# EasyEDA Pro project ProPrj_平衡小车_2024-09-10.epro

# Schematic Schematic1_1
Board Name: Board1_1; Create Date: 2024-08-01; Page Name: 主板; Project Name: 平衡小车; Schematic Name: Schematic1_1; Update Date: 2024-08-01
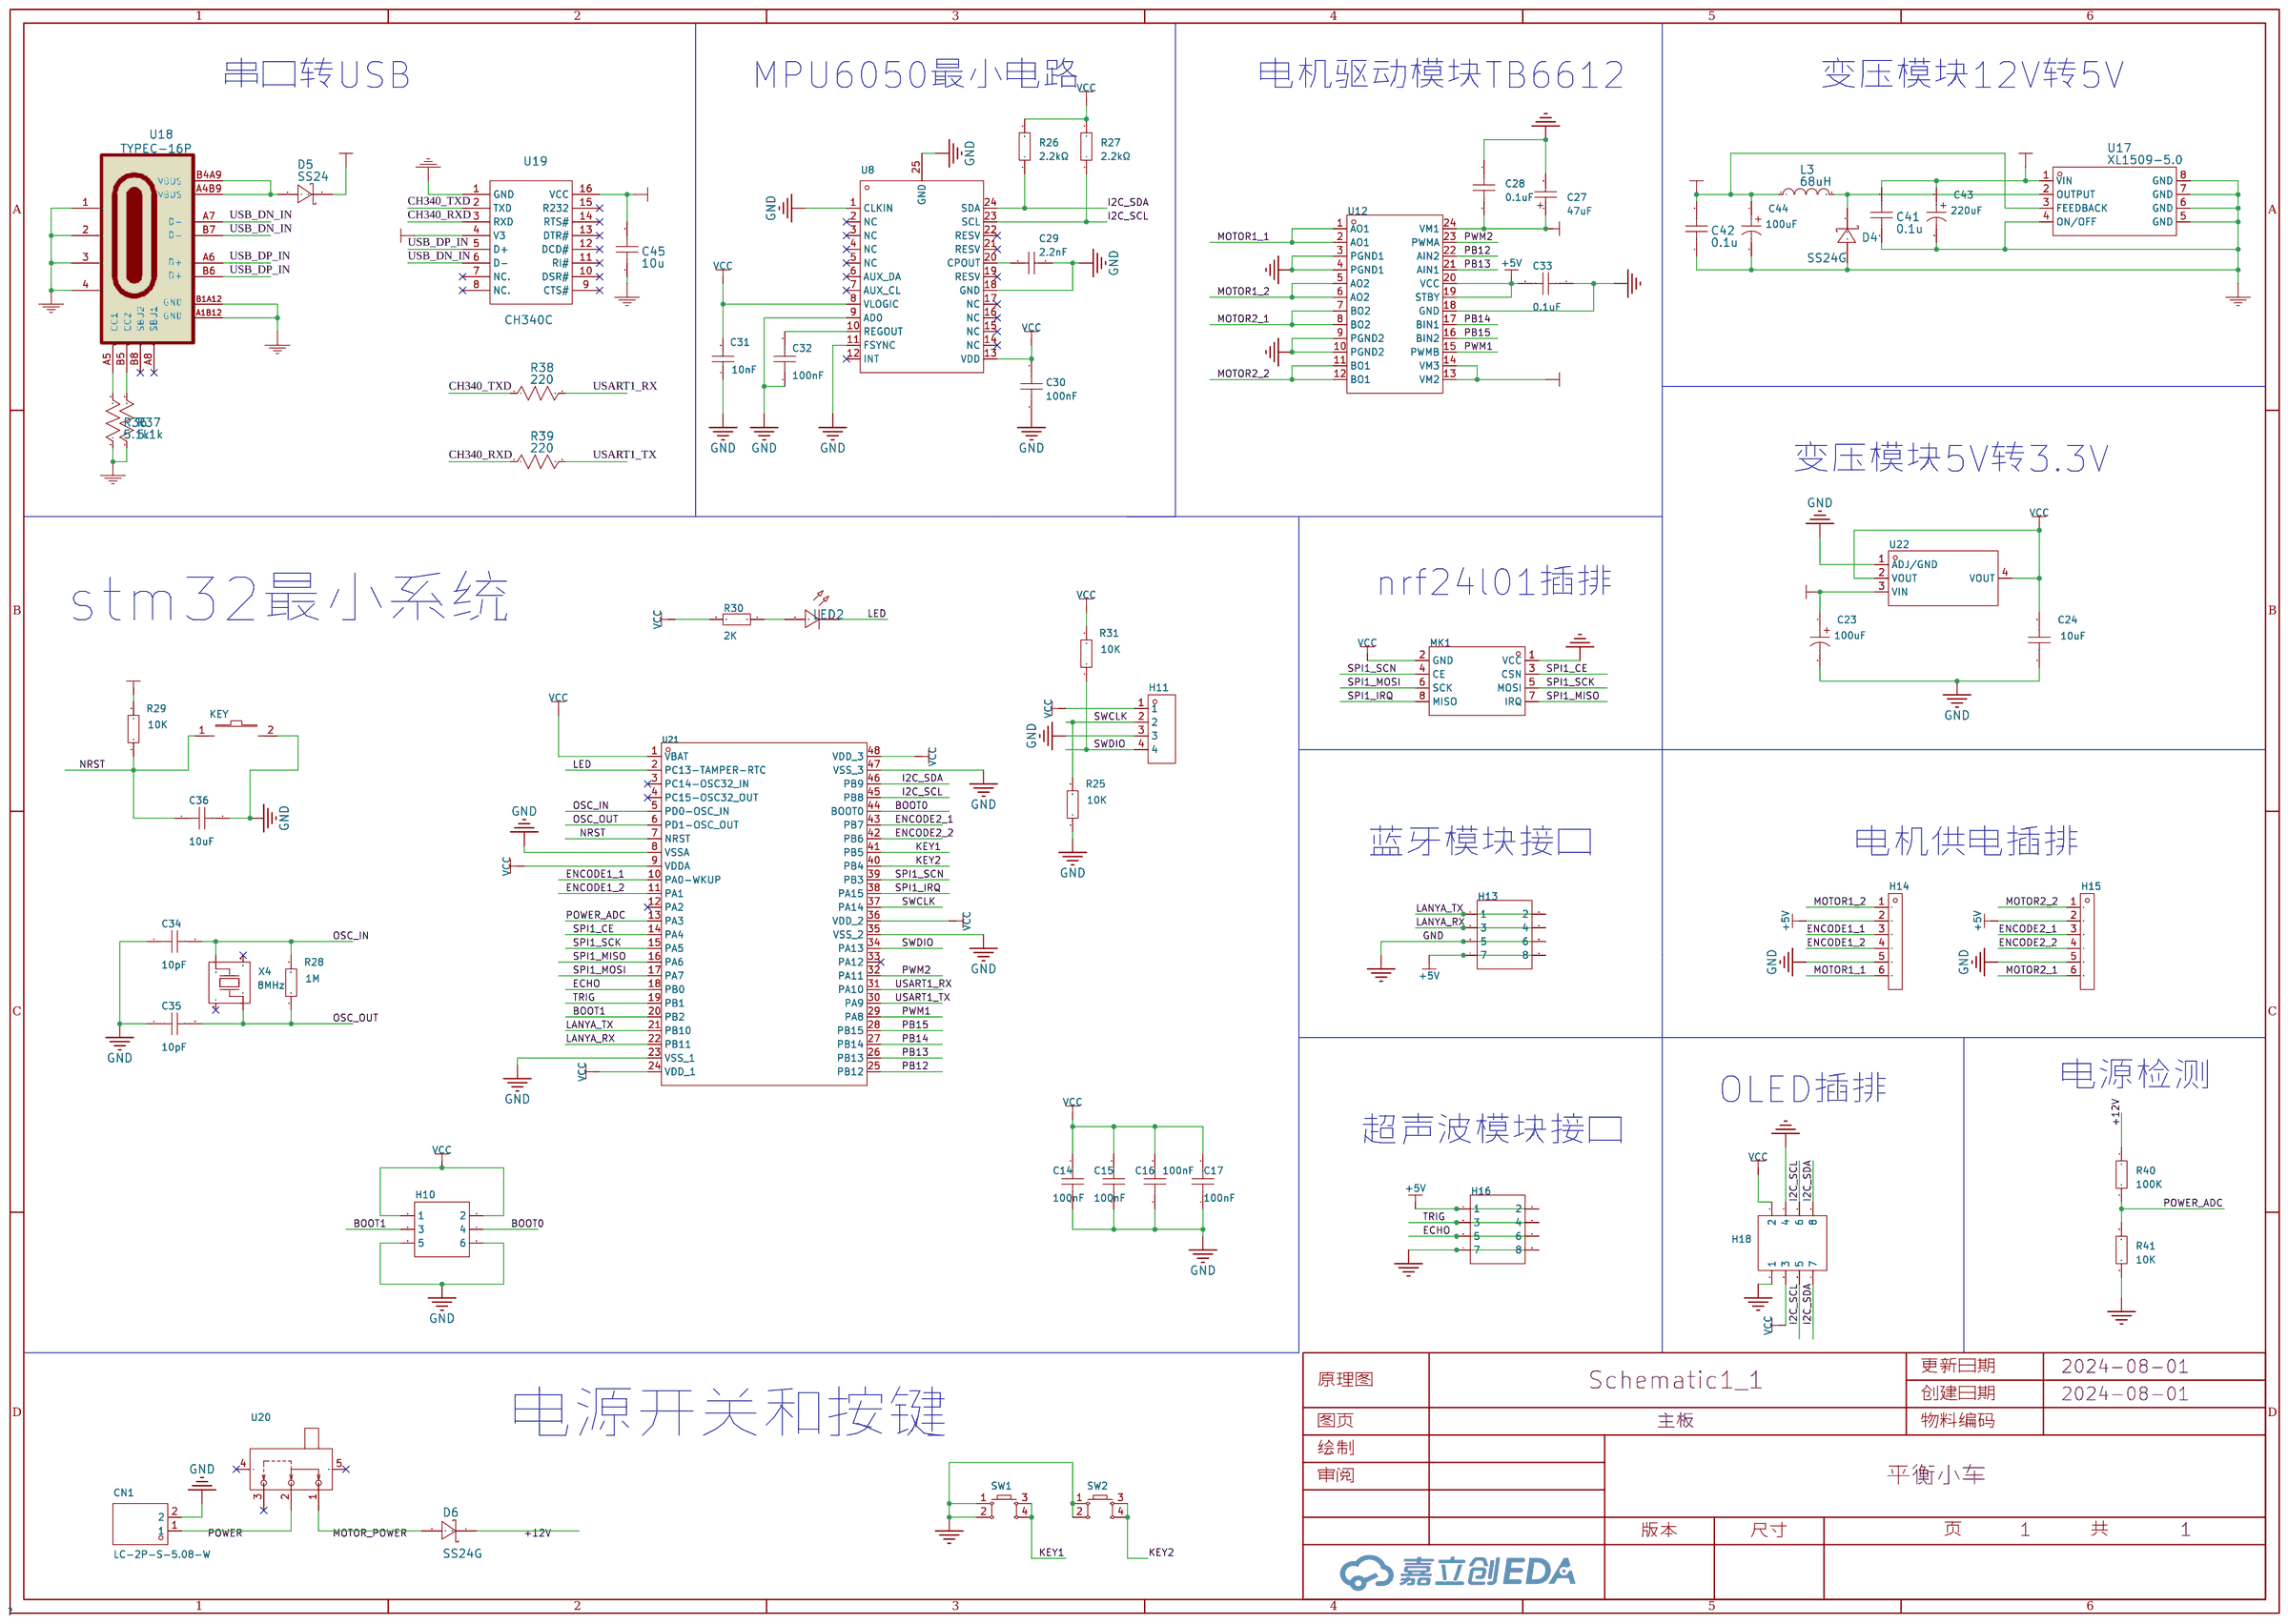
[diagram p0: schematic sheet]

## Parts
C14  100nF  [c0603]
C15  100nF  [c0603]
C16  100nF  [c0603]
C17  100nF  [c0603]
C23  100uF  [CAP-SMD_BD6.3-L6.6-W6.6-LS7.3-FD]
C24  10uF  [C0603]
C27  47uF  [CAP-SMD_L6.0-W3.2-R-RD]
C28  0.1uF  [C0603]
C29  2.2nF  [c0603]
C30  100nF  [c0603]
C31  10nF  [c0603]
C32  100nF  [c0603]
C33  0.1uF  [C0603]
C34  10pF  [C0603]
C35  10pF  [C0603]
C36  10uF  [C0603]
C41  0.1u  [C0603]
C42  0.1u  [C0603]
C43  220uF  [CAP-SMD_BD6.3-L6.6-W6.6-LS7.3-FD]
C44  100uF  [CAP-SMD_BD6.3-L6.6-W6.6-LS7.3-FD]
C45  10u  [C0603]
CN1  LC-2P-S-5.08-W  [CONN-TH_2P-P5.08_2EHDR-02P]
D4  SS24G  [SMA_L4.4-W2.8-LS5.4-RD]
D5  SS24  [SMA_L4.3-W2.6-LS5.2-RD]
D6  SS24G  [SMA_L4.4-W2.8-LS5.4-RD]
H10  -  [HDR-TH_6P-P2.54-V-F-R2-C3-S2.54]
H11  -  [HDR-TH_4P-P2.54-V-M]
H13  -  [HDR-TH_8P-P2.54-V-F-R2-C4-S2.54-1]
H14  -  [CONN-TH_XH-6AW]
H15  -  [CONN-TH_XH-6AW]
H16  -  [HDR-TH_8P-P2.54-V-F-R2-C4-S2.54-1]
H18  -  [HDR-TH_8P-P2.54-V-F-R2-C4-S2.54-1]
KEY  轻触开关3x4x2  [SW-SMD_L4.0-W2.9-LS5.0]
L3  68uH  [IND-SMD_L5.8-W5.2_CD54T125NP-100MC]
LED2  -  [LED0805-RD_RED]
MK1  NF-04  [WIRELM-SMD_NRF24L01]
R25  10K  [R0603]
R26  2.2kΩ  [r0603]
R27  2.2kΩ  [r0603]
R28  1M  [R0603]
R29  10K  [R0603]
R30  2K  [R0603]
R31  10K  [R0603]
R36  5.1k  [R0603]
R37  5.1k  [R0603]
R38  220  [R0603]
R39  220  [R0603]
R40  100K  [R0603]
R41  10K  [R0603]
SW1  -  [SW-TH_4P-L6.0-W6.0-P4.50-LS6.5]
SW2  -  [SW-TH_4P-L6.0-W6.0-P4.50-LS6.5]
U8  -  [QFN-24_L4.0-W4.0-P0.50-BL-EP2.7]
U12  TB6612FNG(O,C,8,EL  [SSOP-24_L8.4-W5.8-P0.65-LS7.8-BL]
U17  XL1509-5.0  [SOIC-8_L5.0-W4.0-P1.27-LS6.0-BL]
U18  TYPEC-16P  [TYPEC]
U19  CH340C  [SOP-16_L10.0-W3.9-P1.27-LS6.0-BL]
U20  SS-12F23-G4  [SW-TH_SS-12F23-G040]
U21  STM32F103C8T6  [LQFP-48_L7.0-W7.0-P0.50-LS9.0-BL]
U22  AMS1117-3.3  [SOT-223_L6.5-W3.5-P2.30-LS7.0-BR]
X4  8MHz  [OSC-SMD_4P-L3.2-W2.5-BL]

## Library data of the parts
C14-C17 = CAP_0805: Supplier Footprint: 0805
C23 C44 = XT100UF16V90RV0074: 容值:100uF;精度:±20%;额定电压:16V;电容体直径:6.3mm;电容体长度:7.7mm;纹波电流:85mA@120Hz;工作寿命:2000hrs@105;工作温度:-55~+105;; LCSC Part Name: 100uF ±20% 16V; Supplier Part: C2992605; Manufacturer: KNSCHA(科尼盛); Supplier Footprint: SMD,D6.3xL7.7mm; Datasheet: https://atta.szlcsc.com/upload/public/pdf/source/20220628/7CAC947F1CF7B3760324B7CEF365CD7C.pdf; Supplier: LCSC; Tolerance: ±20%; Rated Voltage: 16V; φD: 6.3mm; L: 7.7mm; Ripple Current: 85mA@120Hz; Lifetime @ Temp: 2000hrs@105; Operating Temperature: -55~+105
C24 C28 C33-C35 = CAP_0603: Supplier Footprint: 0603
C27 = TAJC476K016RNJ: 容值:47uF;精度:±10%;额定电压:16V;等效串联电阻:500mΩ@100kHz;; LCSC Part Name: 47uF ±10% 16V; Supplier Part: C7219; Manufacturer: Kyocera AVX; Supplier Footprint: CASE-C-6032; JLCPCB Part Class: 扩展库; Datasheet: https://atta.szlcsc.com/upload/public/pdf/source/20160107/1457707749304.pdf; Supplier: LCSC; Tolerance: ±10%; Rated Voltage: 16V; Equivalent Series Resistance(ESR): 500mΩ@100kHz; Operating Temperature: -55℃~+125℃
C29 = 0402B222K500NT: 容值:2.2nF;精度:±10%;额定电压:50V;材质(温度系数):X7R;; LCSC Part Name: 2.2nF ±10% 50V; Supplier Part: C1531; Manufacturer: FH(风华); Supplier Footprint: 0402; JLCPCB Part Class: 基础库; Datasheet: https://atta.szlcsc.com/upload/public/pdf/source/20170923/C1531_1506149258433988338.pdf; Supplier: LCSC; Tolerance: ±10%; Voltage Rated: 50V; Temperature Coefficient: X7R
C30 C32 = CC0402KRX7R7BB104: 容值:100nF;精度:±10%;额定电压:16V;材质(温度系数):X7R;; LCSC Part Name: 100nF ±10% 16V; Supplier Part: C60474; Manufacturer: YAGEO(国巨); Supplier Footprint: 0402; JLCPCB Part Class: 扩展库; Datasheet: https://atta.szlcsc.com/upload/public/pdf/source/20211223/9278FD768280B81DDBEF48FA36411A03.pdf; Supplier: LCSC; Tolerance: ±10%; Voltage Rated: 16V; Temperature Coefficient: X7R
C31 = CC0402KRX7R9BB103: 容值:10nF;精度:±10%;额定电压:50V;温度系数:X7R;; LCSC Part Name: 10nF ±10% 50V; Supplier Part: C60133; Manufacturer: YAGEO(国巨); Supplier Footprint: 0402; JLCPCB Part Class: Extended Part; Datasheet: https://atta.szlcsc.com/upload/public/pdf/source/20151201/1457707601869.pdf; Supplier: LCSC; Tolerance: ±10%; Voltage Rated: 50V; Temperature Coefficient: X7R
C36 = C0603: 容值:100nF;精度:±10%;额定电压:50V;材质(温度系数):X7R;; LCSC Part Name: 100nF ±10% 50V; Supplier Part: C14663; Manufacturer: YAGEO(国巨); Manufacturer Part: CC0603KRX7R9BB104; Supplier Footprint: 0603; JLCPCB Part Class: Basic Part; Datasheet: https://atta.szlcsc.com/upload/public/pdf/source/20170116/1484561234239.pdf; Supplier: LCSC; Tolerance: ±10%; Voltage Rated: 50V; Temperature Coefficient: X7R
C41 C42 = 0.1u
C43 = XT220UF25V90RV0075: 容值:220uF;额定电压:25V;电容体直径:-;电容体长度:-;纹波电流:-;等效串联电阻:-;工作寿命:-;; LCSC Part Name: 220uF 25V; Supplier Part: C2992606; Manufacturer: KNSCHA(科尼盛); Supplier Footprint: SMD,6.3x7.7mm; JLCPCB Part Class: 扩展库; Datasheet: https://atta.szlcsc.com/upload/public/pdf/source/20220628/B81E91792433B702C6CB5381AD404A15.pdf; Supplier: LCSC; Rated Voltage: 25V
C45 = 10u
CN1 = LC-2P-S-5.08-W: Supplier Part: C9900019070; JLCPCB Part Class: 扩展库; Datasheet: https://atta.szlcsc.comnull; Supplier: LCSC
D4 D6 = SS24G: Supplier: LCSC; Supplier Part: C183481; Manufacturer: SK; JLCPCB Part Class: Extended Part
D5 = SS24: Supplier: LCSC; Manufacturer: MDD; Supplier Part: C50645; JLCPCB Part Class: Extended Part
H10 = HDR-F_2.54_2x3: Supplier Part: C92272; Supplier Footprint: 插件
H11 = HDR-M_2.54_1x4P: Supplier Part: C492403; Supplier Footprint: 插件
H13 H16 H18 = HDR-F_2.54_2x4: Supplier Part: C92271; Supplier Footprint: 插件
H14 H15 = XH2.54-6P卧插: 参考系列:XH;间距:2.5mm;插针结构:1x6P;排数:1;每排PIN数:6;行距:-;安装方式:-;触头材质:-;; LCSC Part Name: XH-6AW，6P，脚距2.5mm，卧插; Supplier Part: C8876; Manufacturer: BOOMELE(博穆精密); Manufacturer Part: XH-6AW; LCSC On Sale: 1; Supplier Footprint: 插件,P=2.5mm; JLCPCB On Sale: 1; Datasheet: https://atta.szlcsc.com/upload/public/pdf/source/20151222/1457707652916.pdf; Supplier: LCSC; Reference Series: XH; Pitch: 2.5mm; Pins Structure: 1x6P; Number of Rows: 1; Number of PINs Per Row: 6; JLCPCB Part Class: 扩展库
KEY = 轻触开关3x4x2: 触点电流:50mA;额定电压(DC):12V;电路结构:单刀单掷;安装方式:立贴;按钮形状:圆形按钮;带灯:-;开关长度:4mm;开关宽度:3mm;开关高度:2mm;; LCSC Part Name: 3x4x2  柱高0.5; Supplier Part: C26638; Manufacturer: 国产; Supplier Footprint: SMD; JLCPCB Part Class: 扩展库; Datasheet: https://atta.szlcsc.com/upload/public/pdf/source/20150923/1457707412058.pdf; Supplier: LCSC; Contact Current: 50mA; Voltage Rating (DC): 12V; Circuit: 单刀单掷; Mounting Style: 立贴; Actuator Style: 圆形按钮; Switch Length: 4mm; Switch Width: 3mm; Switch Height: 2mm
L3 = CD54T125NP-100MC: Supplier: LCSC; Supplier Part: C171575; Manufacturer: Sumida; JLCPCB Part Class: Extended Part
LED2 = LED_0805-R: Supplier Footprint: 0805
MK1 = NRF24L01: 低成本NF-04台产芯片 功率加强版 最佳通讯距离240米，2.4G无线通讯模块; LCSC Part Name: NF-04 功率加强版 绑定 2.4G无线模块; Supplier Part: C90751; Manufacturer: Ai-Thinker(安信可); Supplier Footprint: 插件; JLCPCB Part Class: 扩展库; Datasheet: https://atta.szlcsc.com/upload/public/pdf/source/20190912/C90751_790912ADD510BE02DBCDD1D692AB4B0B.pdf; Supplier: LCSC
R25 R28-R31 R40 R41 = Res_0603: Supplier Footprint: 0603
R26 R27 = 0402WGF2201TCE: 电阻类型:厚膜电阻;阻值:2.2kΩ;精度:±1%;功率:62.5mW;温度系数:±100ppm/℃;最大工作电压:50V;工作温度范围:-55℃~+155℃;; LCSC Part Name: 2.2kΩ ±1% 62.5mW; Supplier Part: C25879; Manufacturer: UNI-ROYAL(厚声); Supplier Footprint: 0402; JLCPCB Part Class: 基础库; Datasheet: https://atta.szlcsc.com/upload/public/pdf/source/20200306/C422600_1E6D84923E4A46A82E41ADD87F860B5C.pdf; Supplier: LCSC; Type: 厚膜电阻; Tolerance: ±1%; Power(Watts): 62.5mW; Temperature Coefficient: ±100ppm/℃; Overload Voltage (Max): 50V; Operating Temperature Range: -55℃~+155℃
R36 R37 = 5.1k
R38 R39 = 220
SW1 SW2 = Key_TH_6x6x6: 触点电流:50mA;额定电压(DC):12V;绝缘电阻:100MΩ;电路结构:单刀单掷;安装方式:直插;按钮形状:圆形按钮;按钮/盖帽颜色:黑色;作用力:260gf@±30gf;工作温度:-25℃~+70℃;引脚样式:PC引脚;开关长度:6mm;开关宽度:6mm;开关高度:6mm;带支架:否;; Supplier Part: C2837516; Supplier Footprint: 插件
U8 = MPU-6050: 三轴加速度计和三轴陀螺仪，工作电压：2.375V~3.46V; Supplier Part: C24112; Manufacturer: TDK InvenSense(应美盛); Supplier Footprint: QFN-24_4x4x05P; JLCPCB Part Class: Basic Part; Datasheet: https://atta.szlcsc.com/upload/public/pdf/source/20140425/1457707046159.pdf; Supplier: LCSC
U12 = TB6612FNG(O,C,8,EL: 双直流电机驱动器集成电路; Supplier Part: C88224; Manufacturer: TOSHIBA(东芝); Supplier Footprint: SSOP-24-208mil; JLCPCB Part Class: 扩展库; Datasheet: https://atta.szlcsc.com/upload/public/pdf/source/20170412/1491969113864.pdf; Supplier: LCSC
U17 = XL1509-5.0: Supplier: LCSC; Supplier Part: C2681225; Manufacturer: UMW(友台半导体); JLCPCB Part Class: Extended Part
U18 = TYPEC-16P
U19 = CH340C: Supplier: LCSC; Manufacturer: WCH(南京沁恒); Supplier Part: C84681; JLCPCB Part Class: Extended Part
U20 = SS-12F23-G4: 电路结构:单刀双掷;安装方式:卧插;开关颜色:黑色;滑钮形状:矩形柱状;引脚样式:PC引脚;开关长度:13mm;开关宽度:5.8mm;开关高度:9mm;; LCSC Part Name: 拨动开关; Supplier Part: C2998806; Manufacturer: DEALON(德艺隆); Supplier Footprint: 插件; JLCPCB Part Class: 扩展库; Datasheet: https://atta.szlcsc.com/upload/public/pdf/source/20220428/B341684C4335C21BC408331FBC341DAE.pdf; Supplier: LCSC; Circuit: 单刀双掷; Mounting Style: 卧插; Actuator Color: 黑色; Actuator Style: 矩形柱状; Pin Style: PC引脚; Switch Length: 13mm; Switch Width: 5.8mm; Switch Height: 9mm
U21 = STM32F103C8T6: CPU内核:ARM Cortex-M3;CPU最大主频:72MHz;工作电压范围:2V~3.6V;内部振荡器:有;程序 FLASH容量:64K@x8bit;RAM总容量:20KB;EEPROM/数据 FLASH容量:-;GPIO端口数量:37;ADC(单元数/通道数/位数):1@x10ch/12bit;外设/功能/协议栈:看门狗；DMA；看门狗；片载温度传感器;工作温度范围:-40℃~+85℃;; LCSC Part Name: ARM Cortex-M3 72MHz 闪存：64K@x8bit RAM：20KB MSL=3; Supplier Part: C8734; Manufacturer: ST(意法半导体); Supplier Footprint: LQFP-48(7x7); JLCPCB Part Class: 扩展库; Supplier: LCSC; CPU Core: ARM Cortex-M3; Maximum Frequency: 72MHz; Supply Voltage Range: 2V~3.6V; Internal Oscillator: 有; Program FLASH Size: 64K@x8bit; RAM Size: 20KB; GPIO Ports Number: 37; ADC (Units/Channels/bits): 1@x10ch/12bit; Peripherals / Functions / Protocol Stacks: 看门狗；DMA；看门狗；片载温度传感器; Operating Temperature Range: -40℃~+85℃
U22 = AMS1117-3.3_C351785: Supplier Part: C351785; Manufacturer: PUOLOP(迪浦); Supplier Footprint: SOT-223; JLCPCB Part Class: 扩展库; Datasheet: https://atta.szlcsc.com/upload/public/pdf/source/20210915/EA806799CEEC3F52E0A4FA8303A508AC.pdf; Supplier: LCSC
X4 = TAXM8M4RDBCCT2T: 晶振类型:SMD 谐振器;频率:8MHz;频率公差:±10ppm;频率稳定度:±15ppm;负载电容:10pF;等效串联电阻(ESR):250Ω;工作温度:-;; LCSC Part Name: 8MHz ±10ppm 10pF; Supplier Part: C400090; Manufacturer: TAE(雅晶鑫); Supplier Footprint: SMD3225-4P; JLCPCB Part Class: 扩展库; Datasheet: https://atta.szlcsc.com/upload/public/pdf/source/20190626/C400090_CF95B89E745AFE4EF2E392EF8AC009D6.pdf; Supplier: LCSC; Crystal Type: SMD 谐振器; Frequency Tolerance: ±10ppm; Frequency Stability: ±15ppm; Load Capacitance: 10pF; Equivalent Series Resistance (ESR): 250Ω

## Nets
+5V: C23.1 C33.2 C42.2 C44.1 D5.1(K) H13.7 H13.8 H14.2 H15.2 H16.1 H16.2 L3.1 U12.19(STBY) U12.20(VCC) U17.3(FEEDBACK) U22.3(VIN)
+12V: C41.2 C43.1 D6.1 R40.2 U17.1(VIN)
GND: C14.1 C15.1 C16.1 C17.1 C23.2 C24.1 C27.2 C28.1 C29.2 C30.1 C31.1 C32.1 C33.1 C34.1 C35.1 C36.2 C41.1 C42.1 C43.2 C44.2 C45.1 CN1.2 D4.2 H10.5 H10.6 H11.3 H13.5 H13.6 H14.5 H15.5 H16.7 H16.8 H18.1 H18.4 KEY.2 MK1.1(VCC) R25.1 R36.1 R37.1 R41.1 SW1.1 SW1.2 SW2.1 SW2.2 U8.1(CLKIN) U8.9(AD0) U8.11(FSYNC) U8.18(GND) U8.25(GND) U12.3(PGND1) U12.4(PGND1) U12.9(PGND2) U12.10(PGND2) U12.18(GND) U17.4(ON/OFF) U17.5(GND) U17.6(GND) U17.7(GND) U17.8(GND) U18.1 U18.2(1) U18.3(1) U18.4(1) U18.A1B12(1) U18.B1A12(1) U19.1(GND) U21.8(VSSA) U21.23(VSS_1) U21.35(VSS_2) U21.47(VSS_3) U22.1(ADJ/GND)
VCC: C14.2 C15.2 C16.2 C17.2 C24.2 C30.2 C31.2 C45.2 H10.1 H10.2 H11.1 H18.2 H18.3 MK1.2(GND) R26.2 R27.2 R29.2 R30.2 R31.2 U8.8(VLOGIC) U8.13(VDD) U19.4(V3) U19.16(VCC) U21.1(VBAT) U21.9(VDDA) U21.24(VDD_1) U21.36(VDD_2) U21.48(VDD_3) U22.2(VOUT) U22.4(VOUT)
BOOT0: H10.4 U21.44(BOOT0)
BOOT1: H10.3 U21.20(PB2)
CH340_RXD: R39.1 U19.3(RXD)
CH340_TXD: R38.1 U19.2(TXD)
ECHO: H16.5 H16.6 U21.18(PB0)
ENCODE1_1: H14.3 U21.10(PA0-WKUP)
ENCODE1_2: H14.4 U21.11(PA1)
ENCODE2_1: H15.3 U21.43(PB7)
ENCODE2_2: H15.4 U21.42(PB6)
I2C_SCL: H18.5 H18.6 R27.1 U8.23(SCL) U21.45(PB8)
I2C_SDA: H18.7 H18.8 R26.1 U8.24(SDA) U21.46(PB9)
KEY1: SW1.3 SW1.4 U21.41(PB5)
KEY2: SW2.3 SW2.4 U21.40(PB4)
LANYA_RX: H13.3 H13.4 U21.22(PB11)
LANYA_TX: H13.1 H13.2 U21.21(PB10)
LED: LED2.1(C) U21.2(PC13-TAMPER-RTC)
MOTOR1_1: H14.6 U12.1(AO1) U12.2(AO1)
MOTOR1_2: H14.1 U12.5(AO2) U12.6(AO2)
MOTOR2_1: H15.6 U12.7(BO2) U12.8(BO2)
MOTOR2_2: H15.1 U12.11(BO1) U12.12(BO1)
MOTOR_POWER: C27.1 C28.2 D6.2 U12.13(VM2) U12.14(VM3) U12.24(VM1) U20.1
NRST: C36.1 KEY.1 R29.1 U21.7(NRST)
OSC_IN: C34.2 R28.2 U21.5(PD0-OSC_IN) X4.3
OSC_OUT: C35.2 R28.1 U21.6(PD1-OSC_OUT) X4.1
PB12: U12.22(AIN2) U21.25(PB12)
PB13: U12.21(AIN1) U21.26(PB13)
PB14: U12.17(BIN1) U21.27(PB14)
PB15: U12.16(BIN2) U21.28(PB15)
POWER: CN1.1 U20.2
POWER_ADC: R40.1 R41.2 U21.13(PA3)
PWM1: U12.15(PWMB) U21.29(PA8)
PWM2: U12.23(PWMA) U21.32(PA11)
SPI1_CE: MK1.3(CSN) U21.14(PA4)
SPI1_IRQ: MK1.8(MISO) U21.38(PA15)
SPI1_MISO: MK1.7(IRQ) U21.16(PA6)
SPI1_MOSI: MK1.6(SCK) U21.17(PA7)
SPI1_SCK: MK1.5(MOSI) U21.15(PA5)
SPI1_SCN: MK1.4(CE) U21.39(PB3)
SWCLK: H11.2 R25.2 U21.37(PA14)
SWDIO: H11.4 R31.1 U21.34(PA13)
TRIG: H16.3 H16.4 U21.19(PB1)
USART1_RX: R38.2 U21.31(PA10)
USART1_TX: R39.2 U21.30(PA9)
USB_DN_IN: U18.A7(1) U18.B7(1) U19.6(D-)
USB_DP_IN: U18.A6(1) U18.B6(1) U19.5(D+)
Net-(C29-1): C29.1 U8.20(CPOUT)
Net-(C32-2): C32.2 U8.10(REGOUT)
Net-(D4-1): D4.1 L3.2 U17.2(OUTPUT)
Net-(D5-2): D5.2(A) U18.A4B9(1) U18.B4A9(1)
Net-(LED2-2): LED2.2(A) R30.1
Net-(R36-2): R36.2 U18.A5(1)
Net-(R37-2): R37.2 U18.B5(1)

Not connected (* = marked no-connect by the designer): U8 2(NC)* 3(NC)* 4(NC)* 5(NC)* 6(AUX_DA)* 7(AUX_CL)* 12(INT)* 14(NC)* 15(NC)* 16(NC)* 17(NC)* 19(RESV)* 21(RESV)* 22(RESV)*; U18 A8(1)* B8(1)*; U19 7(NC.)* 8(NC.)* 9(CTS#)* 10(DSR#)* 11(RI#)* 12(DCD#)* 13(DTR#)* 14(RTS#)* 15(R232)*; U20 3* 4* 5*; U21 3(PC14-OSC32_IN)* 4(PC15-OSC32_OUT)* 12(PA2)* 33(PA12)*; X4 2* 4*

## Notes on the sheet
- 串口转USB
- MPU6050最小电路
- 电机驱动模块TB6612
- 变压模块12V转5V
- 变压模块5V转3.3V
- nrf24l01插排
- stm32最小系统
- 蓝牙模块接口
- 电机供电插排
- 电源检测
- OLED插排
- 超声波模块接口
- 电源开关和按键

# Schematic Schematic1
Board Name: Board1; Create Date: 2024-09-07
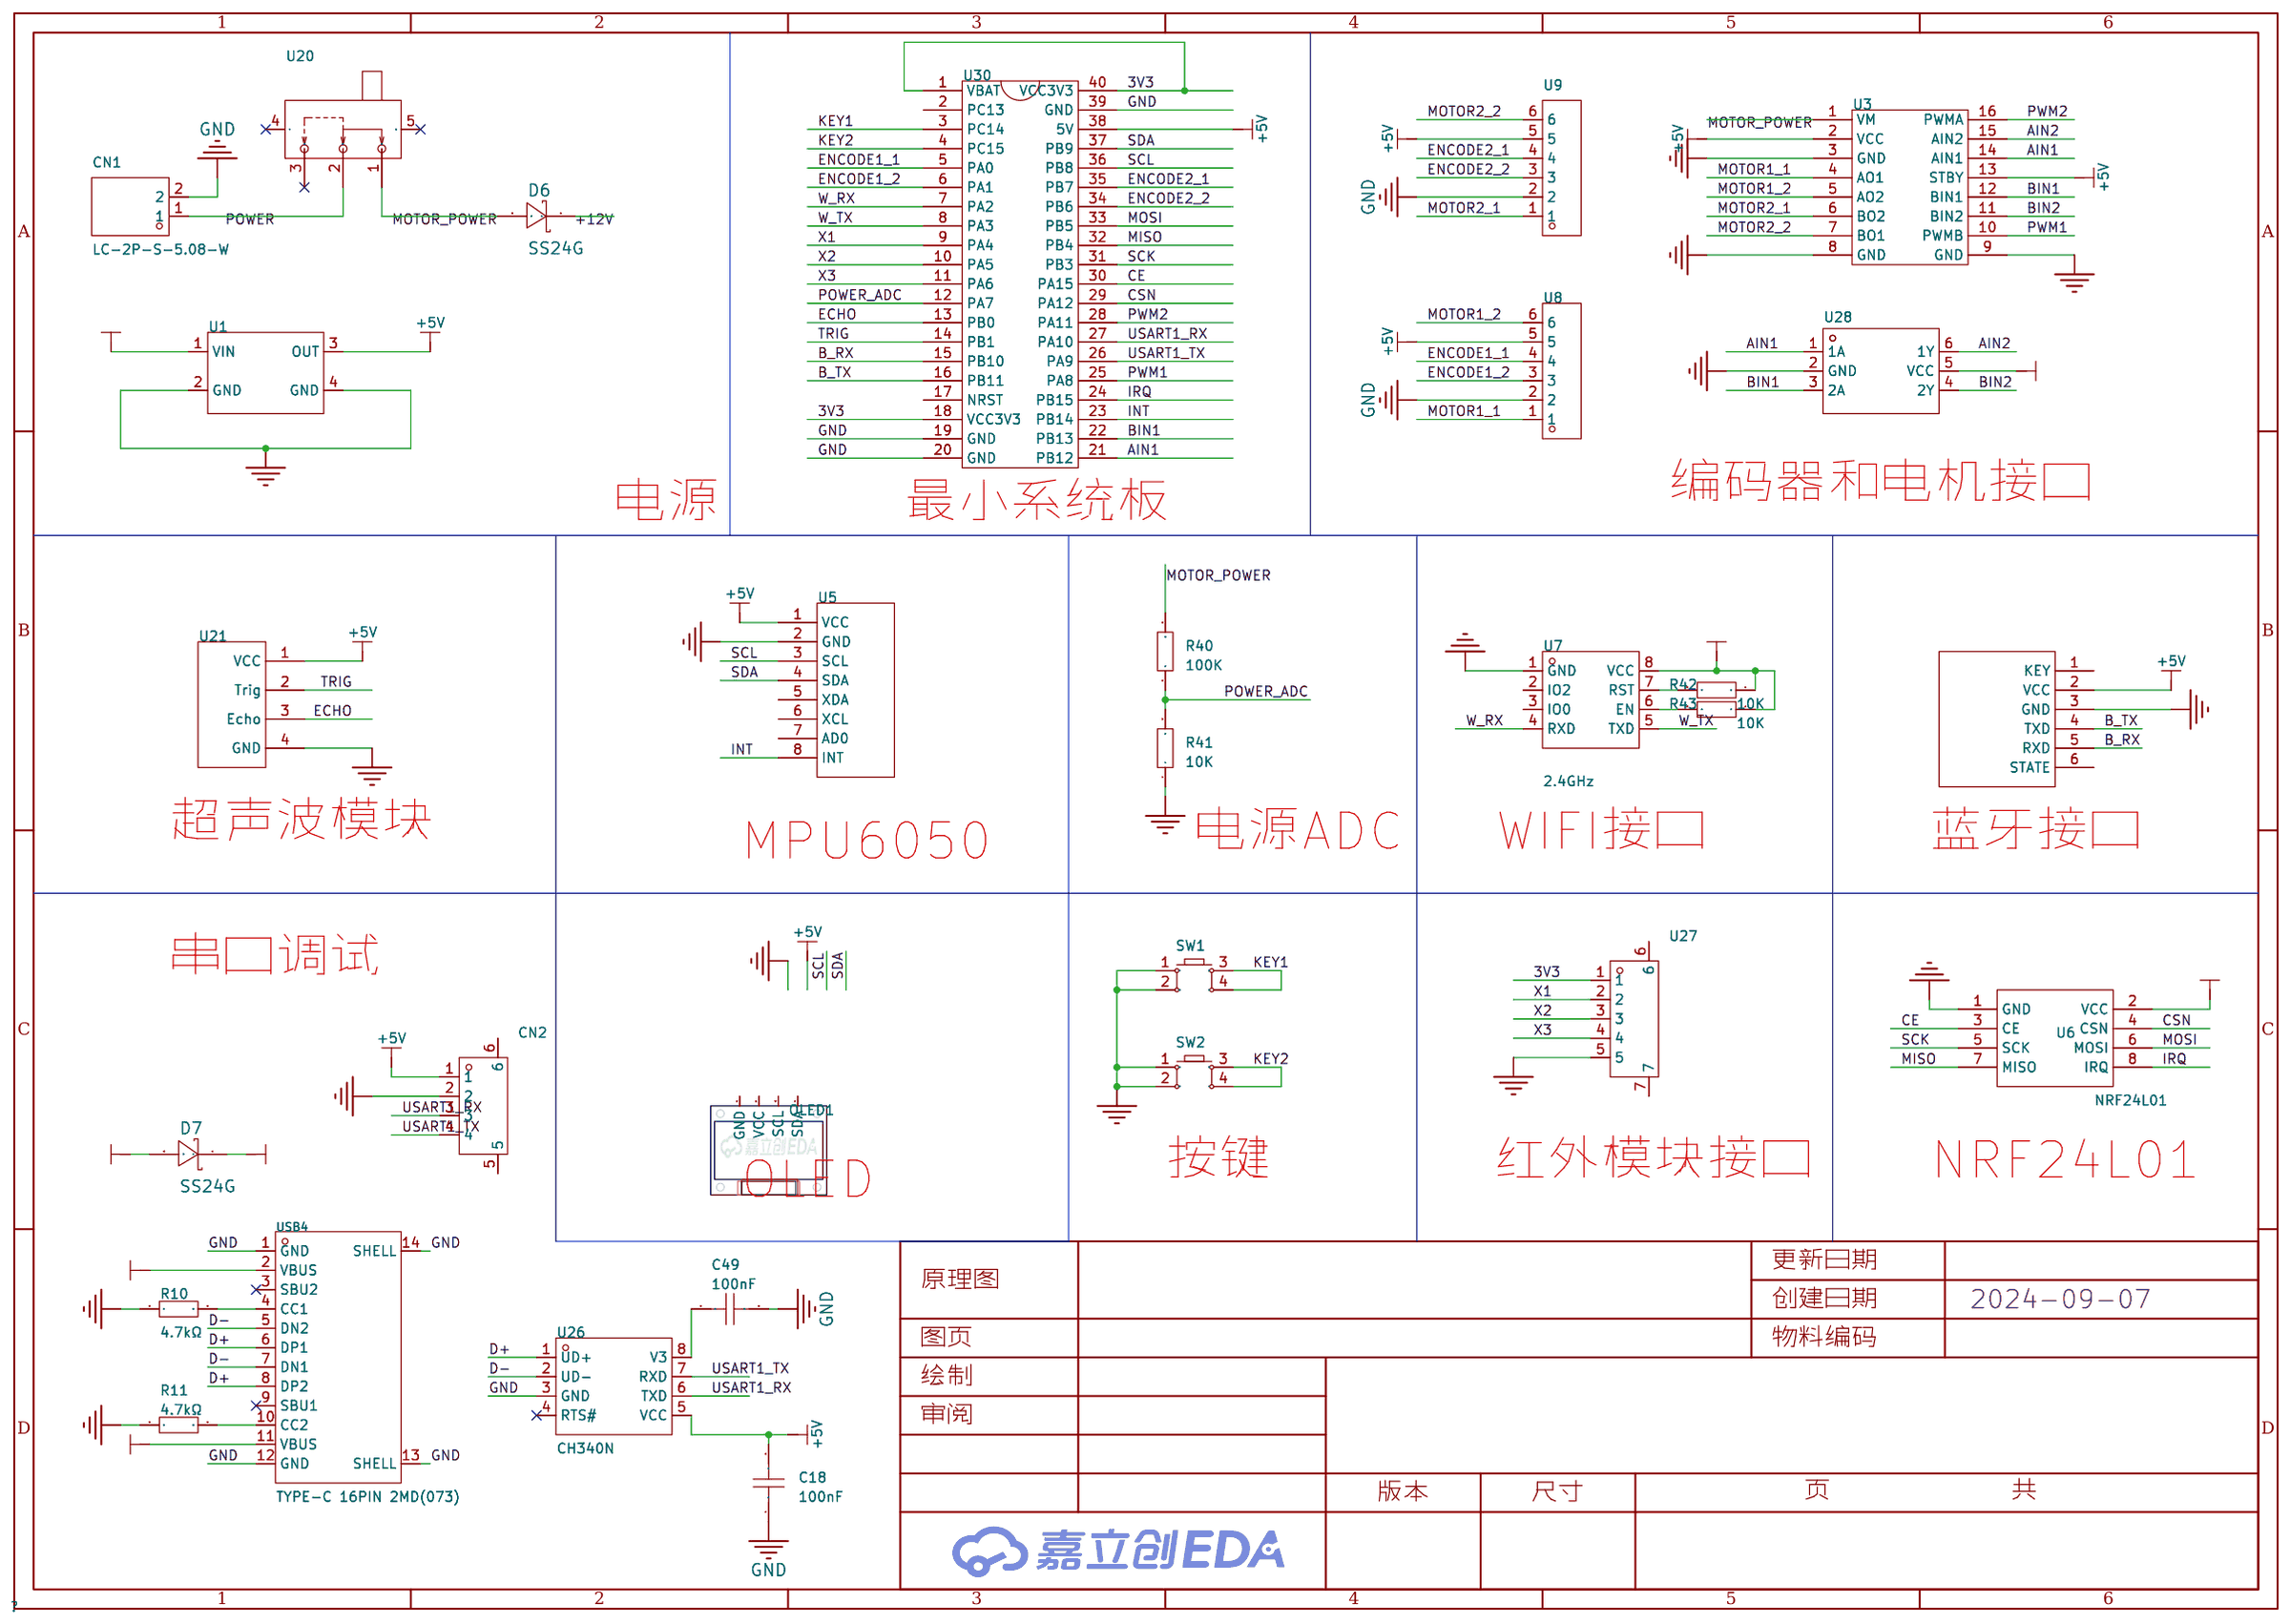
[diagram p1: schematic sheet]

## Parts
BLUETOOTH  JDY-31  [HC-05 PCB]
C18  100nF  [c0603]
C49  100nF  [c0603]
CN1  LC-2P-S-5.08-W  [CONN-TH_2P-P5.08_2EHDR-02P]
CN2  XH2.54-4P  [CONN-SMD_4P-P2.50-WT]
D6  SS24G  [SMA_L4.4-W2.8-LS5.4-RD]
D7  SS24G  [SMA_L4.4-W2.8-LS5.4-RD]
OLED1  -  [0.96OLED_4P]
R10  4.7kΩ  [r0603]
R11  4.7kΩ  [r0603]
R40  100K  [R0603]
R41  10K  [R0603]
R42  10K  [R0603]
R43  10K  [R0603]
SW1  -  [SW-SMD_4P-L6.0-W6.0-P4.50-LS9.0-2]
SW2  -  [SW-SMD_4P-L6.0-W6.0-P4.50-LS9.0-2]
U1  -  [MP1584模块]
U3  TB6612  [TB6612模块]
U5  MPU6050模块  [GY521]
U6  2.4G  [NRF24L01]
U7  2.4GHz  [WIFIM-TH_8P-L24.7-W14.4-P2.54]
U8  WAFER-XH2.54-6PWZ  [CONN-TH_6P-P2.50_WAFER-XH2.54-6PWZ]
U9  WAFER-XH2.54-6PWZ  [CONN-TH_6P-P2.50_WAFER-XH2.54-6PWZ]
U20  SS-12F23-G4  [SW-TH_SS-12F23-G040]
U21  超声波模块  [HC-SRO4超声波模块]
U26  CH340N  [SOP-8_L4.9-W3.9-P1.27-LS6.0-BL]
U27  XH2.54-5P,卧式  [CONN-SMD_5P-P2.50_XUNPU_WAFER-254W-5P]
U28  SN74LVC2GU04DBVR  [SOT-23-6_L2.9-W1.6-P0.95-LS2.8-BR]
U30  STM32C8T6开发板  [STM32C8T6]
USB4  TYPE-C 16PIN 2MD(073)  [USB-C-SMD_TYPE-C-6PIN-2MD-073]

## Library data of the parts
BLUETOOTH = HC-05: Pin Type: IN
C18 C49 = CC0603KRX7R8BB104: 容值:100nF;精度:±10%;额定电压:25V;材质(温度系数):X7R;; LCSC Part Name: 100nF ±10% 25V; Supplier Part: C92490; Manufacturer: YAGEO(国巨); Supplier Footprint: 0603; JLCPCB Part Class: Extended Part; Datasheet: https://atta.szlcsc.com/upload/public/pdf/source/20170105/1483610795587.pdf; Supplier: LCSC; Tolerance: ±10%; Voltage Rated: 25V; Temperature Coefficient: X7R
CN1 = LC-2P-S-5.08-W: Supplier Part: C9900019070; JLCPCB Part Class: 扩展库; Datasheet: https://atta.szlcsc.comnull; Supplier: LCSC
CN2 = XH2.54-4P: Supplier Part: C9900004347; Supplier Footprint: XH2.54-3PSMD; JLCPCB Part Class: 扩展库; Supplier: LCSC
D6 D7 = SS24G: Supplier: LCSC; Supplier Part: C183481; Manufacturer: SK; JLCPCB Part Class: Extended Part
OLED1 = 0.96OLED模块_4P: Supplier Footprint: 插件
R10 R11 = 0603WAF4701T5E: 电阻类型:厚膜电阻;阻值:4.7kΩ;精度:±1%;功率:100mW;最大工作电压:75V;温度系数:±100ppm/℃;; LCSC Part Name: 4.7kΩ ±1% 100mW 厚膜电阻; Supplier Part: C23162; Manufacturer: UNI-ROYAL(厚声); Supplier Footprint: 0603; JLCPCB Part Class: Basic Part; Datasheet: https://atta.szlcsc.com/upload/public/pdf/source/20200306/C422600_1E6D84923E4A46A82E41ADD87F860B5C.pdf; Supplier: LCSC; Type: 厚膜电阻; Tolerance: ±1%; Power(Watts): 100mW; Overload Voltage (Max): 75V; Temperature Coefficient: ±100ppm/℃; Operating Temperature Range: -55℃~+155℃
R40-R43 = Res_0603: Supplier Footprint: 0603
SW1 SW2 = Key_SMD_6x6x6.5: Supplier Footprint: SMD
U1 = MP1584模块: Pin Type: IN; _: 3
U3 = TB6612模块
U5 = MPU6050模块
U6 = NRF24L01
U7 = ESP-01: 核心处理器:-;频率:2.4GHz;天线形式:板载PCB天线;发射功率:16dBm;接收灵敏度:-90dBm;; LCSC Part Name: 体积超小的802.11b/g/nWi-FiSOC模块; Supplier Part: C503581; Manufacturer: Ai-Thinker(安信可); JLCPCB Part Class: 扩展库; Datasheet: https://atta.szlcsc.com/upload/public/pdf/source/20200407/C503581_BFDAA19F4B592DB0CEE4D61B6918C625.pdf; Supplier: LCSC; Support Interface: GPIO；UART; Antenna Type: 板载PCB天线; Output Power: 16dBm; Operating Voltage: 3V~3.6V; Sensitivity: -90dBm; Operating Temperature: -20℃~+85℃
U8 U9 = WAFER-XH2.54-6PWZ: 插针结构:1x6P;间距:2.54mm;安装方式:弯插;总PIN数:6P;排数:1;每排PIN数:6;额定电流:2A;工作温度范围:-25℃~+85℃;; LCSC Part Name: XH 2.54mm 1x6P 弯插; Supplier Part: C5359643; Manufacturer: XUNPU(讯普); Supplier Footprint: 弯插,P=2.5mm; JLCPCB Part Class: 扩展库; Datasheet: https://atta.szlcsc.com/upload/public/pdf/source/20230221/397FB6E0B838EFC6EA17AAEABEF58A8D.pdf; Supplier: LCSC; Pins Structure: 1x6P; Pitch: 2.54mm; Mounting Style: 弯插; Number of Pins: 6P; Number of Rows: 1; Number of PINs Per Row: 6; Current Rating (Max): 2A; Operating Temperature Range: -25℃~+85℃
U20 = SS-12F23-G4: 电路结构:单刀双掷;安装方式:卧插;开关颜色:黑色;滑钮形状:矩形柱状;引脚样式:PC引脚;开关长度:13mm;开关宽度:5.8mm;开关高度:9mm;; LCSC Part Name: 拨动开关; Supplier Part: C2998806; Manufacturer: DEALON(德艺隆); Supplier Footprint: 插件; JLCPCB Part Class: 扩展库; Datasheet: https://atta.szlcsc.com/upload/public/pdf/source/20220428/B341684C4335C21BC408331FBC341DAE.pdf; Supplier: LCSC; Circuit: 单刀双掷; Mounting Style: 卧插; Actuator Color: 黑色; Actuator Style: 矩形柱状; Pin Style: PC引脚; Switch Length: 13mm; Switch Width: 5.8mm; Switch Height: 9mm
U21 = 超声波模块
U26 = CH340N: LCSC Part Name: USB转串口芯片 CH340; Supplier Part: C2977777; Manufacturer: WCH(南京沁恒); Supplier Footprint: SOP-8; JLCPCB Part Class: 扩展库; Datasheet: https://atta.szlcsc.com/upload/public/pdf/source/20230530/6E401E9554E9F5311886CC8B3F89B62E.pdf; Supplier: LCSC
U27 = XH2.54-5P,卧式: Supplier Part: C9900019986; Supplier Footprint: CONN-SMD_5P-P2.50; JLCPCB Part Class: 扩展库; Supplier: LCSC
U28 = SN74LVC2GU04DBVR: 电源电压:1.65V~5.5V;供电电流(最大值):10uA;电路数:2;最大传播延迟(tpd):3.5ns@5V,50pF;; Supplier Part: C139427; Manufacturer: TI(德州仪器); Supplier Footprint: SOT-23-6; JLCPCB Part Class: 扩展库; Datasheet: https://www.ti.com/cn/lit/gpn/sn74lvc2gu04; Supplier: LCSC; Supply Voltage(Single): 1.65V~5.5V; Supply Current (Max): 10uA; Number of Circuits: 2; Number of Inputs: 2; Sink Current: 32mA; Source Current: 32mA; High level range (VIH): 1.24V~4.13V; Low level range (VIL): 410mV~1.38V; Max Propagation Delay: 3.5ns@5V,50pF; Series: 74LVC系列; Operating Temperature: -40℃~+125℃
U30 = STM32C8T6
USB4 = TYPE-C 16PIN 2MD(073): 连接器类型:Type-C;标准:-;公母:母座;触点数量:16;端口数量:1;安装方式:卧贴;额定电流 - 电源:5A;工作温度范围:-25℃~+85℃;; LCSC Part Name: TYPE-C母座 16P 4脚插件带定位柱 不锈钢外壳 2次模顶; Supplier Part: C2765186; Manufacturer: SHOU HAN(首韩); Supplier Footprint: SMD; JLCPCB Part Class: 扩展库; Supplier: LCSC; Connector Type: Type-C; Gender: 母座; Number of Contacts: 16; Number of Ports: 1; Mounting Style: 卧贴; Current Rating - Power (Max): 5A; Operating Temperature Range: -25℃~+85℃

## Nets
3V3: R42.1 R43.1 U6.2(VCC) U7.8(VCC) U27.1 U28.5(VCC) U30.1(VBAT) U30.18(VCC3V3) U30.40(VCC3V3)
+5V: BLUETOOTH.2(VCC) C18.2 CN2.1 D7.1 U1.3(OUT) U3.2(VCC) U3.13(STBY) U5.1(VCC) U8.5 U9.5 U21.1(VCC) U26.5(VCC) U30.38(5V)
+12V: D6.1 U1.1(VIN)
GND: BLUETOOTH.3(GND) C18.1 C49.2 CN1.2 CN2.2 R10.1 R11.1 R41.1 SW1.1 SW1.2 SW2.1 SW2.2 U1.2(GND) U1.4(GND) U3.3(GND) U3.8(GND) U3.9(GND) U5.2(GND) U6.1(GND) U7.1(GND) U8.2 U9.2 U21.4(GND) U26.3(GND) U27.5 U28.2(GND) U30.19(GND) U30.20(GND) U30.39(GND) USB4.1(GND) USB4.12(GND) USB4.13(SHELL) USB4.14(SHELL)
VBUS: D7.2 USB4.2(VBUS) USB4.11(VBUS)
AIN1: U3.14(AIN1) U28.1(1A) U30.21(PB12)
AIN2: U3.15(AIN2) U28.6(1Y)
B_RX: BLUETOOTH.5(RXD) U30.15(PB10)
B_TX: BLUETOOTH.4(TXD) U30.16(PB11)
BIN1: U3.12(BIN1) U28.3(2A) U30.22(PB13)
BIN2: U3.11(BIN2) U28.4(2Y)
CE: U6.3(CE) U30.30(PA15)
CSN: U6.4(CSN) U30.29(PA12)
D+: U26.1(UD+) USB4.6(DP1) USB4.8(DP2)
D-: U26.2(UD-) USB4.5(DN2) USB4.7(DN1)
ECHO: U21.3(Echo) U30.13(PB0)
ENCODE1_1: U8.4 U30.5(PA0)
ENCODE1_2: U8.3 U30.6(PA1)
ENCODE2_1: U9.4 U30.35(PB7)
ENCODE2_2: U9.3 U30.34(PB6)
INT: U5.8(INT) U30.23(PB14)
IRQ: U6.8(IRQ) U30.24(PB15)
KEY1: SW1.3 SW1.4 U30.3(PC14)
KEY2: SW2.3 SW2.4 U30.4(PC15)
MISO: U6.7(MISO) U30.32(PB4)
MOSI: U6.6(MOSI) U30.33(PB5)
MOTOR1_1: U3.4(AO1) U8.1
MOTOR1_2: U3.5(AO2) U8.6
MOTOR2_1: U3.6(BO2) U9.1
MOTOR2_2: U3.7(BO1) U9.6
MOTOR_POWER: D6.2 R40.2 U3.1(VM) U20.1
POWER: CN1.1 U20.2
POWER_ADC: R40.1 R41.2 U30.12(PA7)
PWM1: U3.10(PWMB) U30.25(PA8)
PWM2: U3.16(PWMA) U30.28(PA11)
SCK: U6.5(SCK) U30.31(PB3)
SCL: U5.3(SCL) U30.36(PB8)
SDA: U5.4(SDA) U30.37(PB9)
TRIG: U21.2(Trig) U30.14(PB1)
USART1_RX: CN2.3 U26.6(TXD) U30.27(PA10)
USART1_TX: CN2.4 U26.7(RXD) U30.26(PA9)
W_RX: U7.4(RXD) U30.7(PA2)
W_TX: U7.5(TXD) U30.8(PA3)
X1: U27.2 U30.9(PA4)
X2: U27.3 U30.10(PA5)
X3: U27.4 U30.11(PA6)
$1N2843: C49.1 U26.8(V3)
$1N2852: R10.2 USB4.4(CC1)
$1N2853: R11.2 USB4.10(CC2)
$1N4790: R42.2 U7.7(RST)
$1N4794: R43.2 U7.6(EN)

Not connected (* = marked no-connect by the designer): BLUETOOTH 1(KEY) 6(STATE); CN2 5 6; OLED1 1(GND) 2(VCC) 3(SCL) 4(SDA); U5 5(XDA) 6(XCL) 7(AD0); U7 2(IO2) 3(IO0); U20 3* 4* 5*; U26 4(RTS#)*; U27 6 7; U30 2(PC13) 17(NRST); USB4 3(SBU2)* 9(SBU1)*

## Notes on the sheet
- 电源
- 最小系统板
- 编码器和电机接口
- 超声波模块
- MPU6050
- 电源ADC
- WIFI接口
- 蓝牙接口
- 串口调试
- 按键
- 红外模块接口
- NRF24L01
- OLED

# Board PCB1
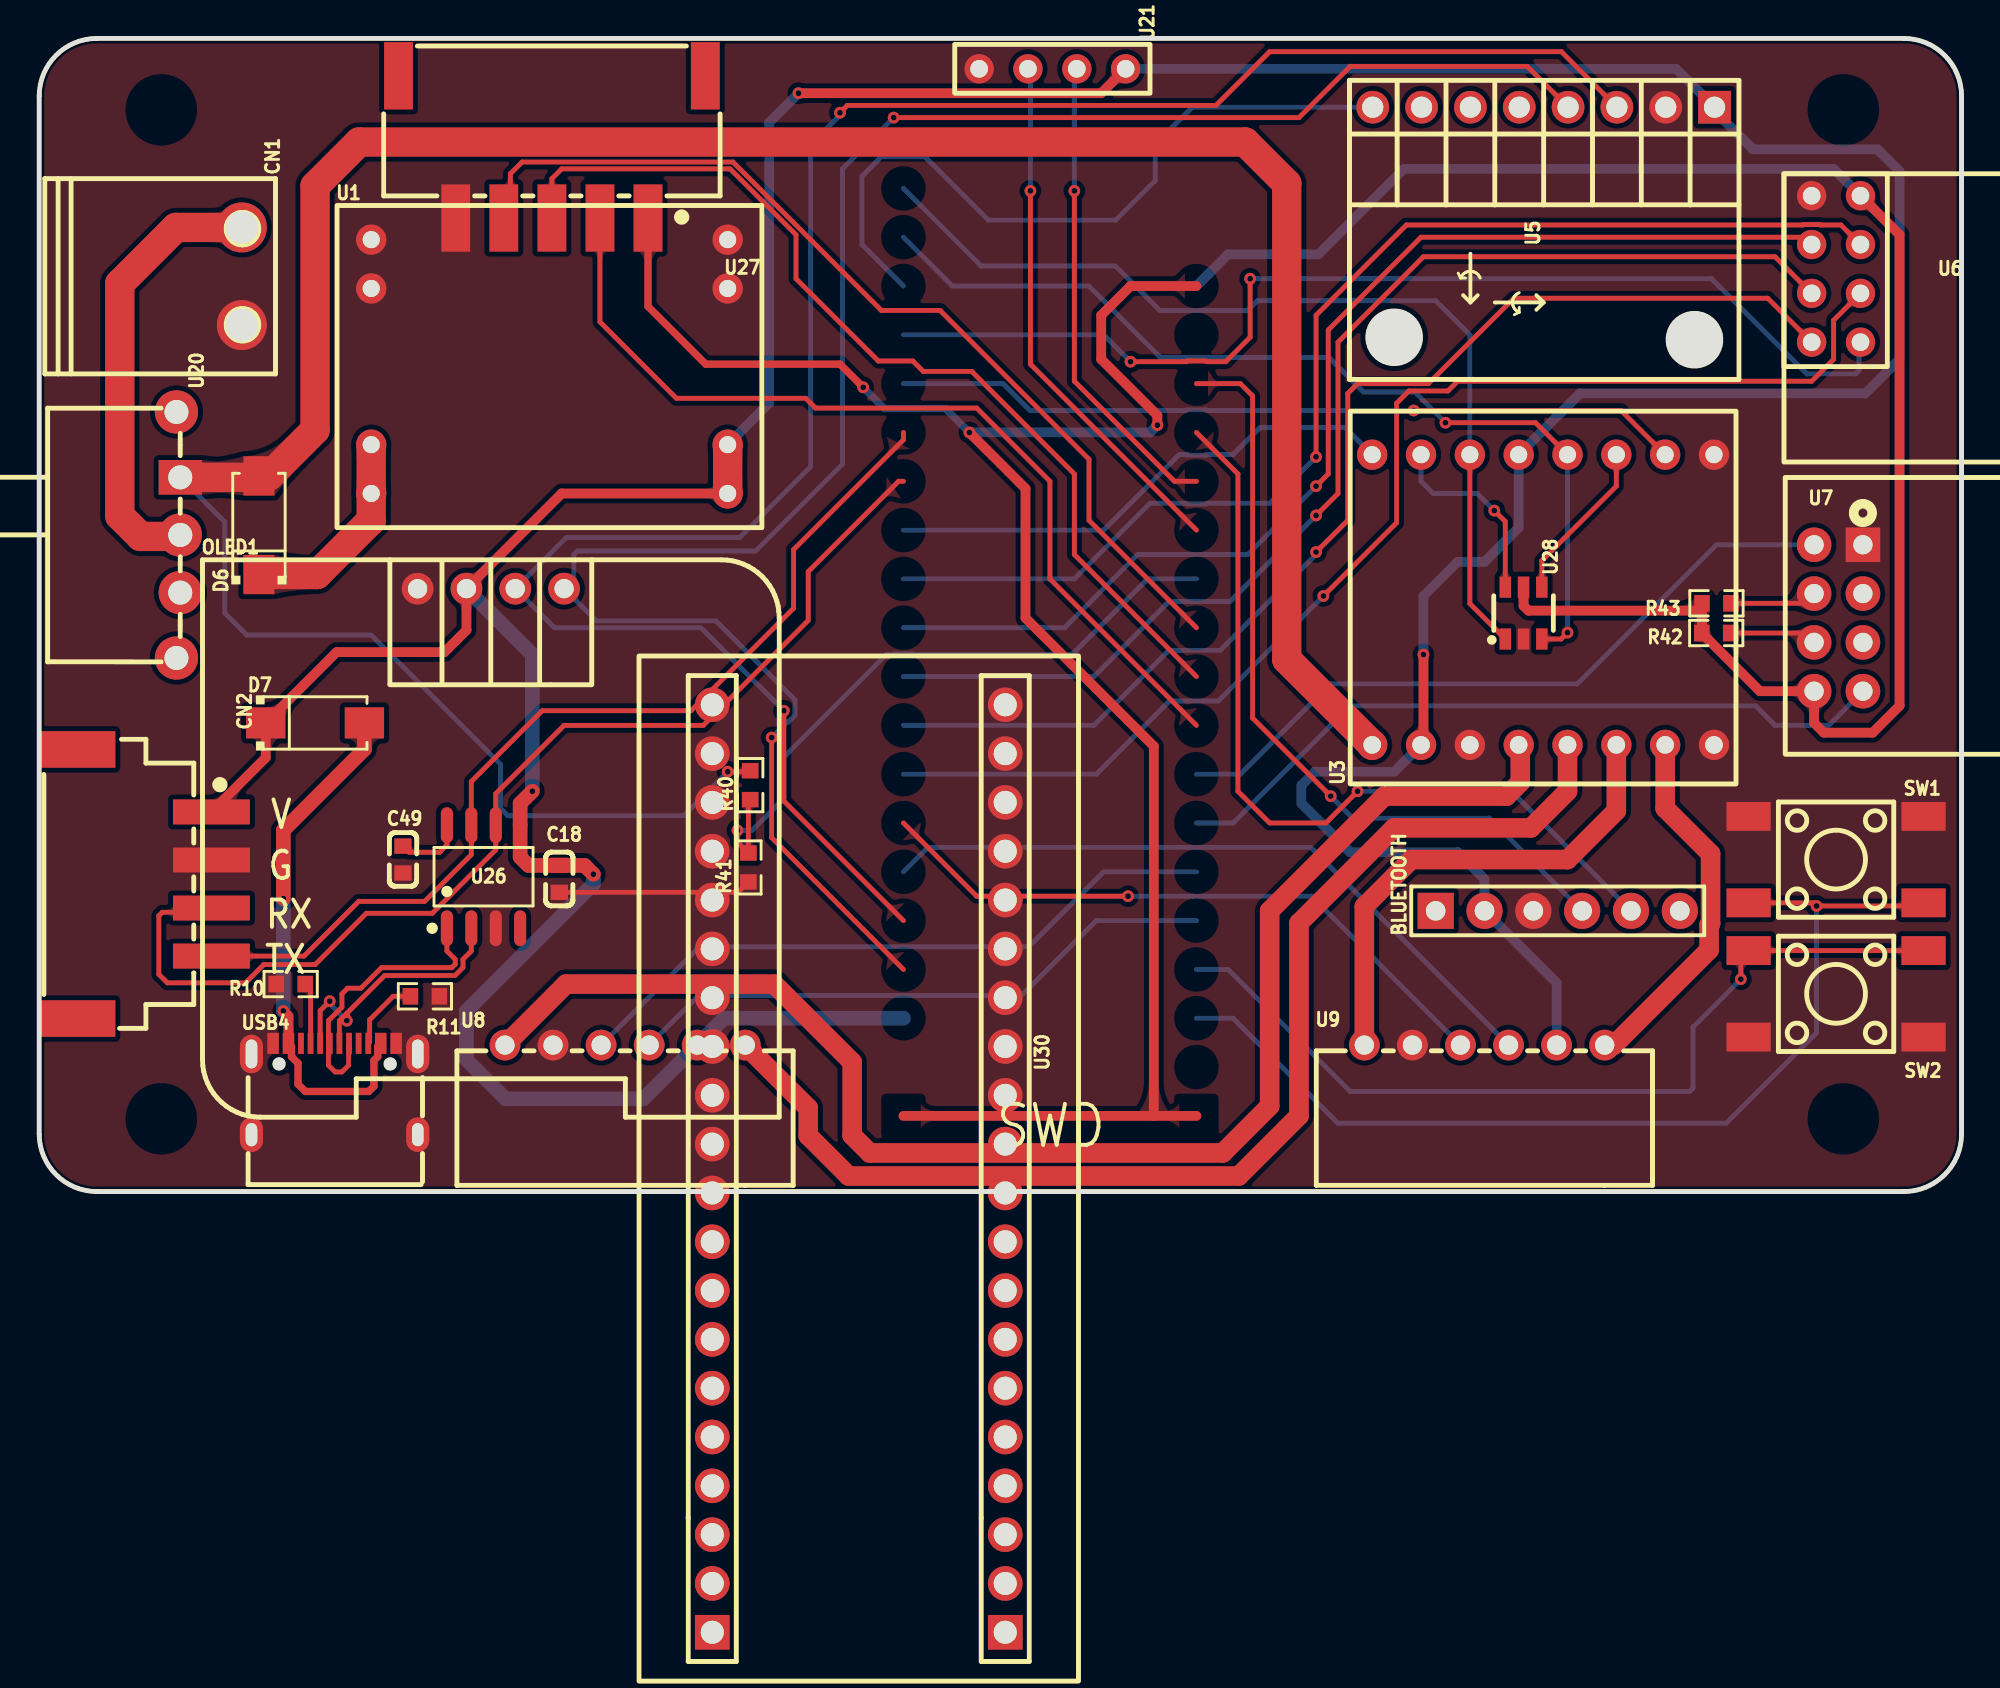
[diagram p2: board, top side]
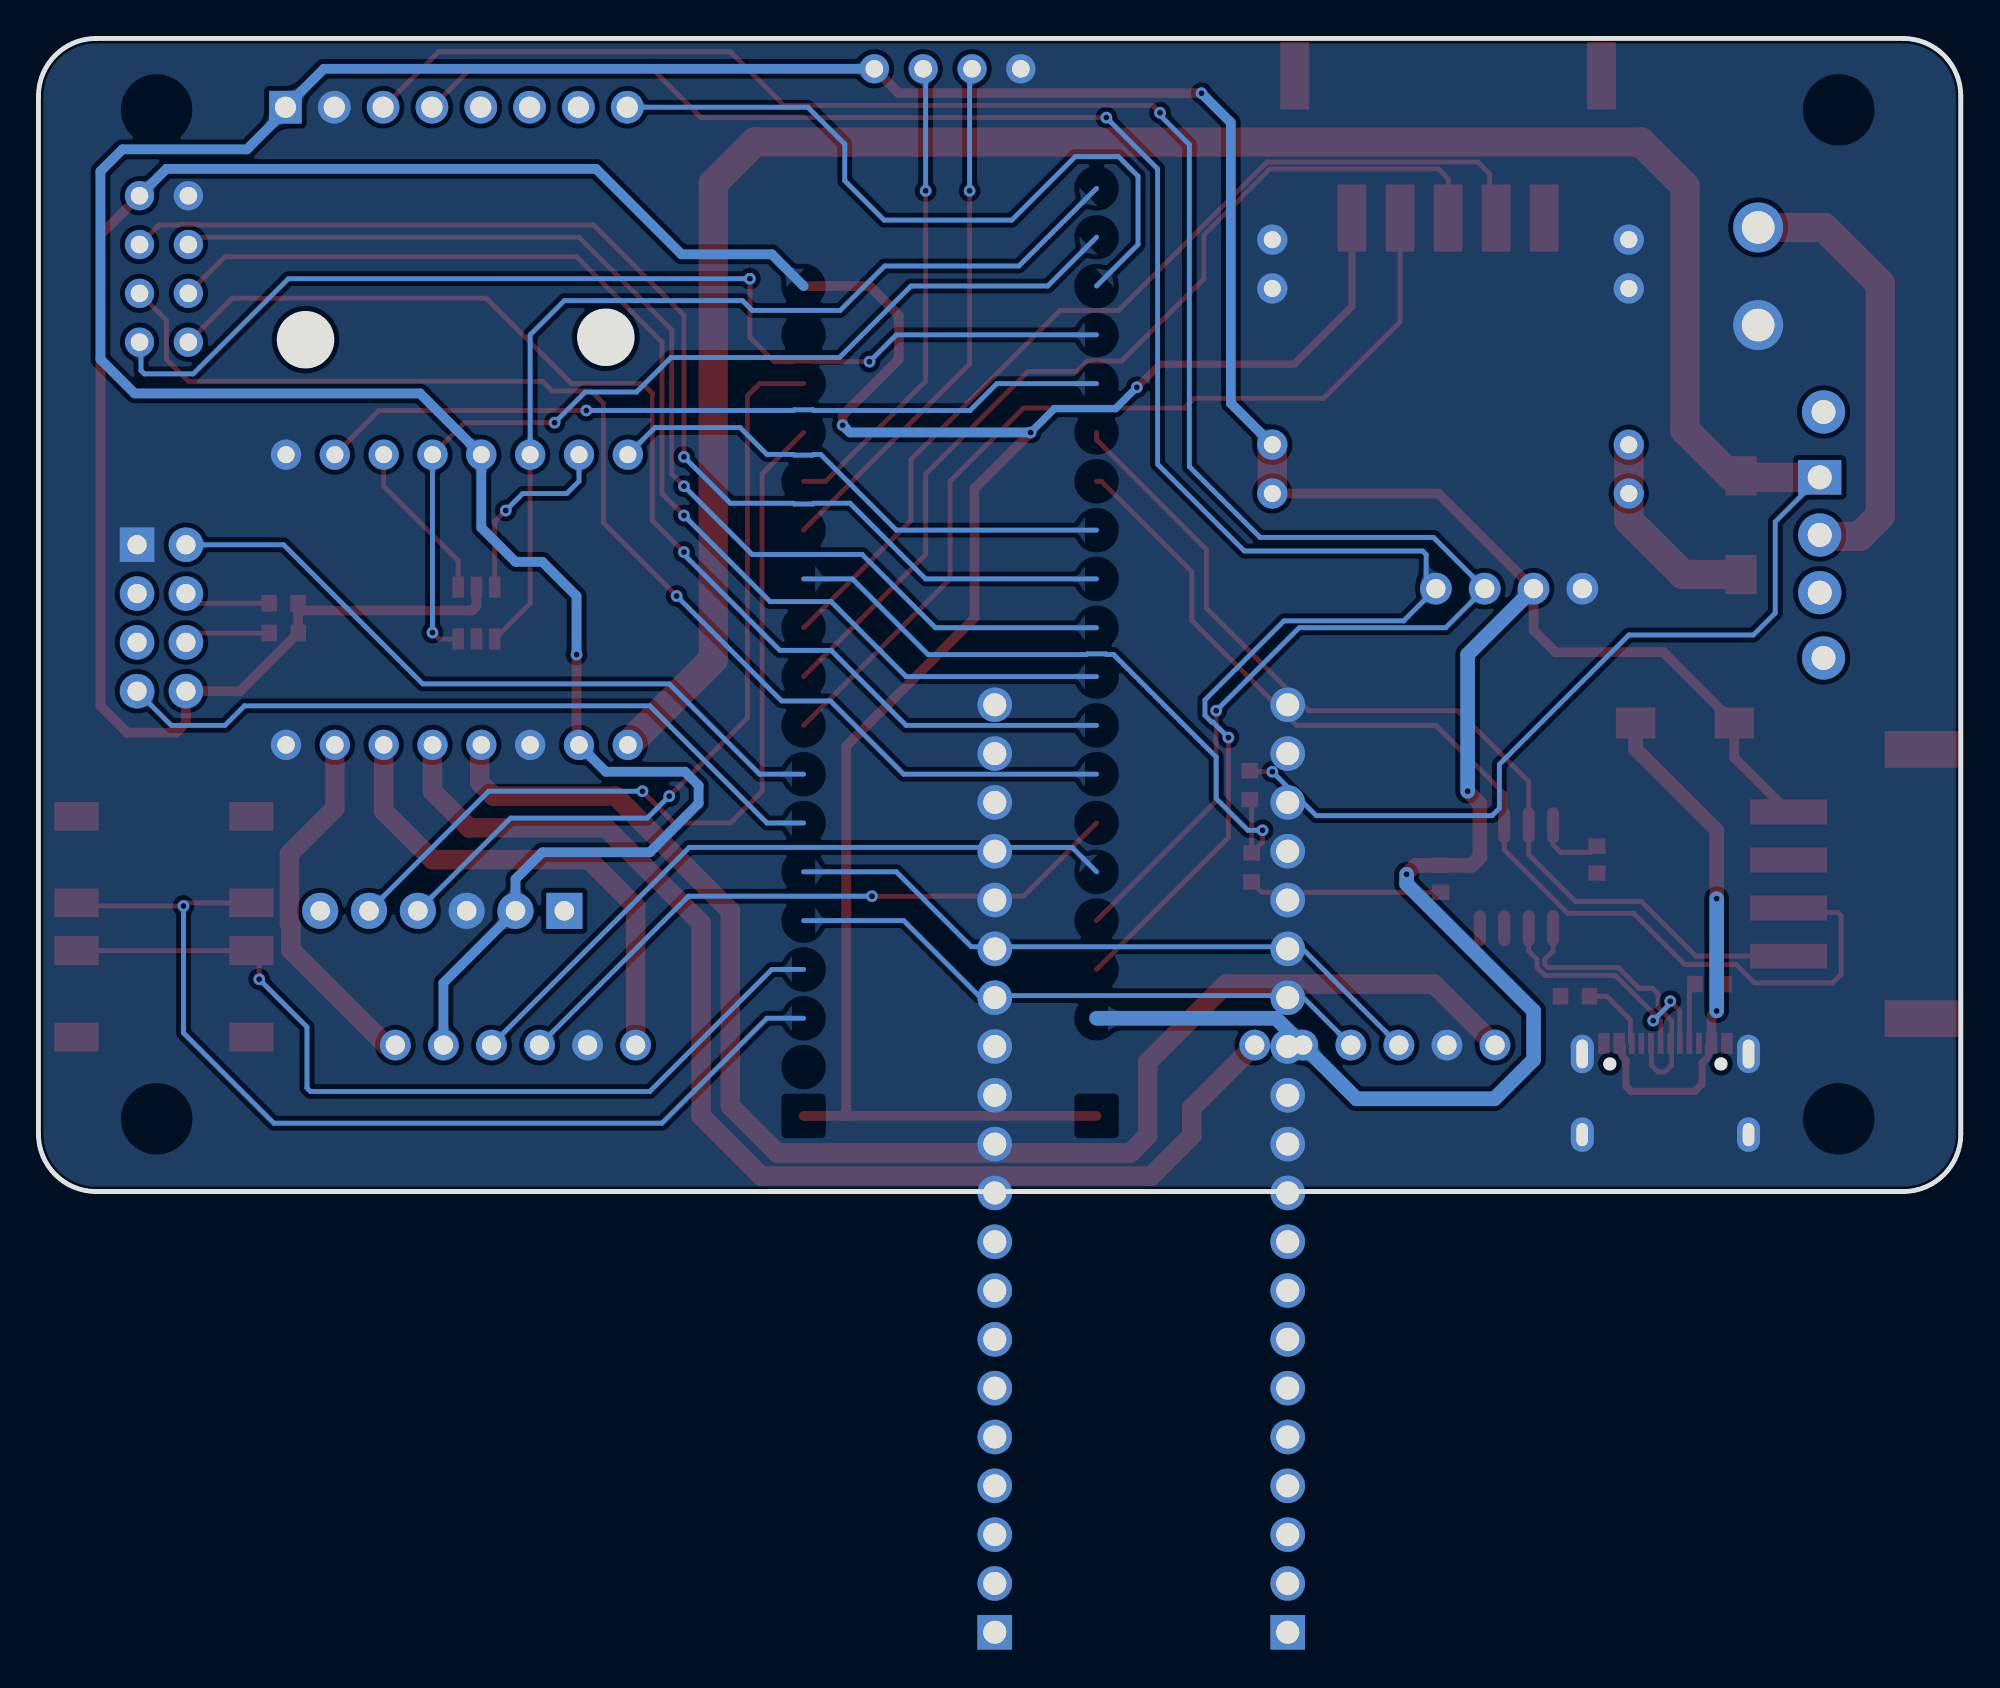
[diagram p3: board, bottom side, seen from below]

Outline 100 x 60 mm; copper layers: Top Layer, Bottom Layer. Coordinates in mm from the lower left corner of the outline.
Outline path: 0,57 0,3 arc(0.88,0.88) 3,0 97,0 arc(99.12,0.88) 100,3 100,57 arc(99.12,59.12) 97,60 3,60 arc(0.88,59.12) 0,57
Stack: Top Layer 0.035mm / Dielectric1 1.51mm FR4 er 4.5 / Bottom Layer 0.035mm

## Design rules (mm)
net D+: DP1
net D-: DP1
template: 自定义配置
spacing copperThickness1oz (default): track to track 0.102, other pairs 0 to 0.3
spacing copperThickness2oz: track to track 0.203, other pairs 0.152 to 0.3
track width copperThickness1oz (default): min 0.127, default 0.254, max 2.54
track width copperThickness2oz: min 0.203, default 0.254, max 2.54
differential pair differentialPair (default): width min 0.127, default 0.254, max 2.54; gap min 0.152, default 0.152
via viaSize (default): diameter min 0.5, default 0.61, max 10; hole min 0.3, default 0.305, max 6.3

## Placement (name value [footprint] x y rotation side)
BLUETOOTH  JDY-31  [HC-05 PCB]  72.64 14.61 90 top
C18  100nF  [c0603]  27.06 16.27 90 top
C49  100nF  [c0603]  18.92 17.27 270 top
CN1  LC-2P-S-5.08-W  [CONN-TH_2P-P5.08_2EHDR-02P]  10.54 47.62 270 top
CN2  XH2.54-4P  [CONN-SMD_4P-P2.50-WT]  5.46 16 270 top
D6  SS24G  [SMA_L4.4-W2.8-LS5.4-RD]  11.43 34.67 90 top
D7  SS24G  [SMA_L4.4-W2.8-LS5.4-RD]  14.35 24.38 0 top
OLED1  -  [0.96OLED_4P]  23.5 31.37 0 top
R10  4.7kΩ  [r0603]  13.08 10.79 0 top
R11  4.7kΩ  [r0603]  20.07 10.16 180 top
R40  100K  [R0603]  36.99 21.14 90 top
R41  10K  [R0603]  36.89 16.86 90 top
R42  10K  [R0603]  87.24 29.06 0 top
R43  10K  [R0603]  87.25 30.61 0 top
SW1  -  [SW-SMD_4P-L6.0-W6.0-P4.50-LS9.0-2]  93.47 17.27 0 top
SW2  -  [SW-SMD_4P-L6.0-W6.0-P4.50-LS9.0-2]  93.47 10.29 180 top
U1  -  [MP1584模块]  26.54 42.93 0 top
U3  TB6612  [TB6612模块]  87.12 23.24 90 top
U5  MPU6050模块  [GY521]  78.36 50.04 270 top
U6  2.4G  [NRF24L01]  104.39 58.93 180 top
U7  2.4GHz  [WIFIM-TH_8P-L24.7-W14.4-P2.54]  93.6 29.84 0 top
U8  WAFER-XH2.54-6PWZ  [CONN-TH_6P-P2.50_WAFER-XH2.54-6PWZ]  30.48 7.62 0 top
U9  WAFER-XH2.54-6PWZ  [CONN-TH_6P-P2.50_WAFER-XH2.54-6PWZ]  75.18 7.62 0 top
U20  SS-12F23-G4  [SW-TH_SS-12F23-G040]  7.24 34.16 270 top
U21  超声波模块  [HC-SRO4超声波模块]  54.86 58.17 270 top
U26  CH340N  [SOP-8_L4.9-W3.9-P1.27-LS6.0-BL]  23.11 16.38 0 top
U27  XH2.54-5P,卧式  [CONN-SMD_5P-P2.50_XUNPU_WAFER-254W-5P]  26.67 54.36 180 top
U28  SN74LVC2GU04DBVR  [SOT-23-6_L2.9-W1.6-P0.95-LS2.8-BR]  77.22 30.1 270 top
U30  STM32C8T6开发板  [STM32C8T6]  41.15 1.4 90 top
USB4  TYPE-C 16PIN 2MD(073)  [USB-C-SMD_TYPE-C-6PIN-2MD-073]  15.37 5.33 0 top

## Footprints (pads in the part's own frame, mm; a bottom-side part is the same pattern mirrored in y, then rotated)
0.96OLED_4P
  round 1.65 hole 1: 1(-3.81,-0.002) 2(-1.27,0.002) 3(1.27,0.002) 4(3.81,0.002)
c0603
  rect 0.8x0.9 smd: 1(-0.7,0) 2(0.7,0)
CONN-SMD_4P-P2.50-WT
  rect 1.3x4 smd: 1(-3.75,3.5) 2(-1.25,3.5) 3(1.25,3.5) 4(3.751,3.5)
  rect 1.9x4 smd: 5(7,-3.5) 6(-7,-3.5)
CONN-SMD_5P-P2.50_XUNPU_WAFER-254W-5P
  rect 1.5x3.5 smd: 1(-5,3.7) 2(-2.5,3.7) 3(0,3.7) 4(2.5,3.7) 5(5,3.7) 6(-7.98,-3.7) 7(7.98,-3.7)
CONN-TH_2P-P5.08_2EHDR-02P
  round 2.6 hole 1.7: 1(-2.54,0) 2(2.54,0)
CONN-TH_6P-P2.50_WAFER-XH2.54-6PWZ
  round 1.6 hole 1: 1(-6.25,0) 2(-3.75,0) 3(-1.25,0) 4(1.25,0) 5(3.75,0) 6(6.25,0)
GY521
  rect 1.7x1.7 hole 1.1: 1(-6.383,8.792)
  round 1.7 hole 1.1: 2(-6.383,6.252) 3(-6.383,3.712) 4(-6.383,1.172) 5(-6.383,-1.368) 6(-6.383,-3.908) 7(-6.383,-6.448) 8(-6.383,-8.988)
HC-05 PCB
  rect 1.879x1.879 hole 1.016: 1(0,0)
  round 1.879 hole 1.016: 2(0,-2.54) 3(0,-5.08) 4(0,-7.62) 5(0,-10.16) 6(0,-12.7)
HC-SRO4超声波模块
  round 1.524 hole 0.914: 1(-0.254,1.651) 2(-0.254,-0.889) 3(-0.254,-3.429) 4(-0.254,-5.969)
MP1584模块
  round 1.575 hole 0.889: 1(-9.271,-4.064) 1(-9.271,-6.604) 2(-9.271,6.604) 2(-9.271,4.064) 3(9.271,-4.064) 3(9.271,-6.604) 4(9.271,6.604) 4(9.271,4.064)
NRF24L01
  round 1.524 hole 0.914: 1(12.192,7.112) 2(9.652,7.112) 3(12.192,9.652) 4(9.652,9.652) 5(12.192,12.192) 6(9.652,12.192) 7(12.192,14.732) 8(9.652,14.732)
r0603
  rect 0.806x0.864 smd: 1(-0.753,0) 2(0.753,0)
R0603
  rect 0.806x0.864 smd: 1(-0.753,0) 2(0.753,0)
SMA_L4.4-W2.8-LS5.4-RD
  rect 2.046x1.62 smd: 1(-2.566,0) 2(2.566,0)
SOP-8_L4.9-W3.9-P1.27-LS6.0-BL
  oval 0.63x1.865 smd: 1(-1.905,-2.683) 2(-0.635,-2.683) 3(0.635,-2.683) 4(1.905,-2.683) 5(1.905,2.683) 6(0.635,2.683) 7(-0.635,2.683) 8(-1.905,2.683)
SOT-23-6_L2.9-W1.6-P0.95-LS2.8-BR
  rect 1.1x0.6 smd: 1(1.35,-0.95) 2(1.35,0) 3(1.35,0.95) 4(-1.35,0.95) 5(-1.35,0) 6(-1.35,-0.95)
STM32C8T6
  rect 1.8x1.8 hole 1.2: 1(-24.33,-9.105) 40(-24.33,6.135)
  round 1.8 hole 1.2: 2(-21.79,-9.105) 3(-19.25,-9.105) 4(-16.71,-9.105) 5(-14.17,-9.105) 6(-11.63,-9.105) 7(-9.09,-9.105) 8(-6.55,-9.105) 9(-4.01,-9.105) 10(-1.47,-9.105) 11(1.07,-9.105) 12(3.61,-9.105) 13(6.15,-9.105) 14(8.69,-9.105) 15(11.23,-9.105) 16(13.77,-9.105) 17(16.31,-9.105) 18(18.85,-9.105) 19(21.39,-9.105) 20(23.93,-9.105) 21(23.93,6.135) 22(21.39,6.135) 23(18.85,6.135) 24(16.31,6.135) 25(13.77,6.135) 26(11.23,6.135) 27(8.69,6.135) 28(6.15,6.135) 29(3.61,6.135) 30(1.07,6.135) 31(-1.47,6.135) 32(-4.01,6.135) 33(-6.55,6.135) 34(-9.09,6.135) 35(-11.63,6.135) 36(-14.17,6.135) 37(-16.71,6.135) 38(-19.25,6.135) 39(-21.79,6.135)
SW-SMD_4P-L6.0-W6.0-P4.50-LS9.0-2
  rect 2.3x1.5 smd: 1(-4.55,2.25) 2(4.55,2.25) 3(-4.55,-2.25) 4(4.55,-2.25)
SW-TH_SS-12F23-G040
  rect 1.801x2.251 hole 1.25: 1(-2.999,0.099)
  round 2.251 hole 1.25: 2(0,0.099) 3(2.999,0.099) 4(6.401,-0.099) 5(-6.401,-0.099)
TB6612模块
  round 1.575 hole 0.889x0.914: 1(0,17.78) 2(0,15.24) 3(0,12.7) 4(0,10.16) 5(0,7.62) 6(0,5.08) 7(0,2.54) 8(0,0)
  round 1.575 hole 0.889: 9(15.101,0) 10(15.101,2.54) 11(15.101,5.08) 12(15.101,7.62) 13(15.101,10.16) 14(15.101,12.7) 15(15.101,15.24) 16(15.101,17.78)
USB-C-SMD_TYPE-C-6PIN-2MD-073
  rect 0.6x1.1 smd: 1(-3.2,2.375) 2(-2.4,2.375) 11(2.4,2.375) 12(3.2,2.375)
  rect 0.3x1.1 smd: 3(-1.75,2.375) 4(-1.25,2.375) 5(-0.75,2.375) 6(-0.25,2.375) 7(0.25,2.375) 8(0.75,2.375) 9(1.25,2.375) 10(1.75,2.375)
  oval 1.2x2 hole 0.6x1.5: 13(-4.325,1.825) 14(4.325,1.825)
  oval 1.2x1.8 hole 0.6x1.2: 13(-4.325,-2.375) 14(4.325,-2.375)
WIFIM-TH_8P-L24.7-W14.4-P2.54
  rect 1.8x1.8 hole 1: 1(1.27,3.81)
  round 1.8 hole 1: 2(1.27,1.27) 3(1.27,-1.27) 4(1.27,-3.81) 5(-1.27,3.81) 6(-1.27,1.27) 7(-1.27,-1.27) 8(-1.27,-3.81)

## Nets
As in the schematic, except:
+5V: BLUETOOTH.2 C18.2 CN2.1 D7.1 OLED1.2 U1.3 U3.2 U3.13 U5.1 U8.5 U9.5 U21.1 U26.5 U30.38
GND: BLUETOOTH.3 C18.1 C49.2 CN1.2 CN2.2 OLED1.1 R10.1 R11.1 R41.1 SW1.1 SW1.2 SW2.1 SW2.2 U1.2 U1.4 U3.3 U3.8 U3.9 U5.2 U6.1 U7.1 U8.2 U9.2 U21.4 U26.3 U27.5 U28.2 U30.19 U30.20 U30.39 USB4.1 USB4.12 USB4.13 USB4.14
SCL: OLED1.3 U5.3 U30.36
SDA: OLED1.4 U5.4 U30.37

Pads without a net: BLUETOOTH 1 6; CN2 5 6; U5 5 6 7; U7 2 3; U20 3 4 5; U26 4; U27 6 7; U30 2 17; USB4 3 9

## Via types
v1: diameter 0.61, hole 0.305, Top Layer to Bottom Layer, 35 vias

## Routing (per net, layer and track width the routed paths; a pad name or vN(x,y) marks a point on that pad's centre or on a via; arc(x,y) is an arc through that point)
3V3: length 192.2
  Top Layer w0.254: R43.1 86.5,30.35
  Top Layer w0.381: v1(42.86,41.85) 41.66,43.05 34.67,43.05 31.67,46.05 U27.1
  Top Layer w0.508: 57.98,3.94 60.2,3.94 ; 57.98,3.94 57.98,23.17 51.31,29.84 51.31,36.58 v1(48.39,39.5) ; 57.98,3.94 44.96,3.94 ; U6.2 96.77,49.78 96.77,25.27 95.38,23.88 92.84,23.88 92.33,24.38 U7.8 89.51,26.03 R42.1 86.5,29.07 86.5,30.35 86.37,30.23 77.47,30.23 77.22,30.48 U28.5 ; 60.2,47.12 56.77,47.12 55.25,45.59 55.25,43.31 58.17,40.39 v1(58.17,39.88)
  Bottom Layer w0.381: v1(42.86,41.85) 43.97,40.74 47.14,40.74 v1(48.39,39.5)
  Bottom Layer w0.508: 60.2,47.12 61.85,48.77 66.55,48.77 70.99,53.21 93.34,53.21 U6.2 ; v1(58.17,39.88) 57.78,39.5 v1(48.39,39.5)
+5V: length 255.1
  Top Layer w0.508: v1(72.01,27.94) 72.01,23.37 U3.2 ; v1(39.5,57.15) 55.25,57.15 U21.1 ; CN2.1 11.79,22.58 D7.1 15.47,28.07 21.08,28.07 22.22,29.21 22.22,31.37 27.18,36.32 U1.3
  Top Layer w0.762: v1(25.65,20.83) 25.02,20.19 U26.5 25.02,17.4 25.45,16.97 C18.2 28.37,16.97 v1(28.83,16.51)
  Top Layer w1.524: U1.3 U1.3
  Bottom Layer w0.508: U9.5 78.93,10.85 BLUETOOTH.2 75.18,16.26 73.79,17.65 68.2,17.65 65.66,20.19 65.66,21.13 66.37,21.84 70.49,21.84 U3.2 ; U1.3 37.97,41.02 37.97,55.63 v1(39.5,57.15) ; v1(72.01,27.94) 72.01,30.99 73.79,32.77 75.18,32.77 76.96,34.54 U3.13 80.15,41.53 95,41.53 96.77,43.31 96.77,53.09 95.63,54.23 89.15,54.23 87.15,56.23 U5.1 85.15,58.42 U21.1
  Bottom Layer w0.762: v1(25.65,20.83) 25.65,27.94 22.22,31.37 ; 44.96,9.02 35.63,9.02 U8.5 31.44,4.83 24.26,4.83 22.22,6.86 22.22,9.4 28.83,16 v1(28.83,16.51)
+12V: length 10.9
  Top Layer w1.524: U1.1 U1.1 17.27,34.92 14.45,32.11 D6.1
GND: length 10.1
  Top Layer w0.254: R41.1 36.36,15.57 C18.1
VBUS: length 27.5
  Top Layer w0.381: USB4.2 13.12,7.55 13.12,7.02 13.46,6.68 13.46,5.59 13.84,5.21 17.14,5.21 17.41,5.48 17.41,6.82 17.61,7.02 17.61,7.55 USB4.11
  Top Layer w0.508: USB4.2 12.97,9.13 v1(12.7,9.4)
  Top Layer w0.762: v1(12.7,15.24) 12.7,18.8 16.92,23.01 D7.2
  Bottom Layer w0.762: v1(12.7,15.24) v1(12.7,9.4)
AIN1: length 49.6
  Top Layer w0.254: U3.14 74.42,30.59 76.27,28.75
  Bottom Layer w0.254: 44.96,52.2 49,48.16 55.98,48.16 58.29,45.85 62.87,45.85 63.37,46.36 72.64,46.36 74.42,44.58 U3.14
AIN2: length 10
  Top Layer w0.254: U28.6 76.27,34.86 v1(75.69,35.43)
  Bottom Layer w0.254: U3.15 71.88,36.96 72.52,36.32 74.8,36.32 v1(75.69,35.43)
B_RX: length 44
  Top Layer w0.254: 60.2,39.5 62.36,37.34 62.36,20.83 64.01,19.18 66.93,19.18 v1(68.58,20.83)
  Bottom Layer w0.254: BLUETOOTH.5 76.58,20.83 v1(68.58,20.83)
B_TX: length 41.2
  Top Layer w0.254: 60.2,42.04 62.48,42.04 63.12,41.4 63.12,24.64 v1(67.18,20.57)
  Bottom Layer w0.254: v1(67.18,20.57) 68.33,19.43 75.44,19.43 BLUETOOTH.4
BIN1: length 50
  Top Layer w0.254: 78.17,28.75 79.17,28.75 v1(79.5,29.08) ; U3.12 77.84,40 v1(73.15,40)
  Bottom Layer w0.254: v1(73.15,40) 71.56,41.6 68.89,41.6 67.09,43.4 58.33,43.4 54.61,47.12 47.5,47.12 44.96,49.66 ; v1(79.5,29.08) U3.12
BIN2: length 8.5
  Top Layer w0.254: U28.4 78.17,32.83 82.04,36.7 U3.11
CE: length 60.2
  Top Layer w0.254: v1(66.42,36.7) 67.06,37.34 67.06,44.83 71.88,49.66 91.82,49.66 U6.3
  Bottom Layer w0.254: v1(66.42,36.7) 62.87,33.15 57.15,33.15 53.34,29.34 44.96,29.34
CSN: length 62.2
  Top Layer w0.254: v1(66.42,38.23) 66.42,45.59 71.12,50.29 91.75,50.29 91.77,50.32 92.63,50.32 92.66,50.29 93.73,50.29 U6.4
  Bottom Layer w0.254: 44.96,31.88 53.85,31.88 57.78,35.81 59.67,35.81 59.71,35.78 60.69,35.78 60.72,35.81 64.01,35.81 v1(66.42,38.23)
D+: length 15.1
  Top Layer w0.254: U26.1 21.21,12.51 21.64,12.08 21.64,11.83 21.46,11.65 17.81,11.65 16.73,10.58 16.04,10.58 15.75,10.29 15.75,9.59 15.05,8.89 15.05,6.57 15.39,6.22 15.75,6.22 16.09,6.57 16.09,7.52 16.12,7.54 USB4.8
D-: length 15.2
  Top Layer w0.254: 16,9.27 15.62,8.89 USB4.7 ; 16,9.27 17.97,11.24 21.63,11.24 22.05,11.66 22.05,12.08 22.48,12.51 U26.2 ; 16,9.27 16.05,9.23 16.05,8.93 v1(16,8.89) ; v1(15.11,9.91) 14.62,9.41 USB4.5
  Bottom Layer w0.254: v1(15.11,9.91) 15.11,9.78 v1(16,8.89)
ECHO: length 27.6
  Top Layer w0.254: v1(51.56,52.07) 51.56,43.05 60.2,34.42
  Bottom Layer w0.254: U21.3 51.56,58.29 v1(51.56,52.07)
ENCODE1_1: length 31.2
  Bottom Layer w0.254: U8.4 34.31,10.2 51.09,10.2 54.99,14.1 60.2,14.1
ENCODE1_2: length 34.7
  Bottom Layer w0.254: U8.3 34.35,12.74 51.47,12.74 55.37,16.64 60.2,16.64
ENCODE2_1: length 36.3
  Bottom Layer w0.254: 44.96,16.64 46.23,17.91 66.15,17.91 U9.4
ENCODE2_2: length 33.8
  Top Layer w0.254: 44.96,19.18 48.77,15.37 v1(56.64,15.37)
  Bottom Layer w0.254: U9.3 66.19,15.37 v1(56.64,15.37)
INT: length 38.5
  Bottom Layer w0.254: U5.8 59.98,56.42 58.06,54.5 58.06,52.59 56.01,50.55 49.37,50.55 46.07,53.85 43.81,53.85 42.8,52.83 42.8,49.28 44.96,47.12
IRQ: length 57.5
  Top Layer w0.254: v1(56.77,43.18) 59.67,43.18 59.71,43.22 60.69,43.22 60.72,43.18 61.72,43.18 62.99,44.45 v1(62.99,47.5)
  Bottom Layer w0.254: U6.8 94.67,44.12 94.67,42.72 94.49,42.55 91.95,42.55 87,47.5 v1(62.99,47.5) ; 44.96,44.58 55.37,44.58 v1(56.77,43.18)
KEY1: length 52.3
  Top Layer w0.254: SW1.3 92.29,15.02 v1(92.46,14.86) 97.86,14.86 SW1.4
  Bottom Layer w0.254: 60.2,9.02 62.1,9.02 67.56,3.56 87.76,3.56 92.46,8.25 v1(92.46,14.86)
KEY2: length 46
  Top Layer w0.254: v1(88.52,11.05) 88.52,12.13 SW2.4 SW2.3
  Bottom Layer w0.254: 60.2,11.56 61.85,11.56 68.2,5.21 85.85,5.21 86.03,5.39 86.03,8.56 v1(88.52,11.05)
MISO: length 61.3
  Top Layer w0.254: v1(66.42,33.27) 68.07,34.92 68.07,41.53 68.58,42.04 72.26,42.04 76.71,46.48 89.92,46.48 U6.7
  Bottom Layer w0.254: v1(66.42,33.27) 66.42,33.15 61.43,28.16 58.76,28.16 54.86,24.26 44.96,24.26
MOSI: length 65
  Top Layer w0.254: U6.6 93.34,45.34 93.34,43.31 92.2,42.16 73.79,42.16 73.28,41.66 71.25,41.66 70.61,41.02 70.61,34.8 v1(66.8,30.99)
  Bottom Layer w0.254: v1(66.8,30.99) 61.34,25.53 58.8,25.53 54.99,21.72 44.96,21.72
MOTOR1_1: length 75.9
  Top Layer w1.016: U8.1 27.41,10.79 38.23,10.79 42.29,6.73 42.29,2.92 43.21,2.01 61.57,2.01 64.01,4.44 64.01,14.61 69.98,20.57 76.33,20.57 77.05,21.29 77.05,23.16 U3.4
MOTOR1_2: length 63
  Top Layer w1.016: U3.5 79.5,20.83 77.6,18.92 70.49,18.92 65.53,13.97 65.53,3.94 62.4,0.81 42.1,0.81 40,2.91 40,4.34 U8.6
MOTOR2_1: length 25.8
  Top Layer w1.016: U3.6 82.04,19.81 79.5,17.27 71.37,17.27 68.93,14.83 U9.1
MOTOR2_2: length 19.2
  Top Layer w1.016: U9.6 81.91,7.62 86.87,12.57 86.87,13.87 86.94,13.94 86.94,17.58 84.58,19.94 U3.7
MOTOR_POWER: length 146.2
  Top Layer w0.254: v1(35.81,21.84) 36.93,21.84 R40.2
  Top Layer w1.524: U3.1 64.9,27.69 64.9,52.45 62.74,54.61 16.64,54.61 14.35,52.32 14.35,39.62 11.96,37.24 D6.2 11.36,37.16 U20.1
  Bottom Layer w0.254: U20.1 9.65,34.85 9.65,30.1 10.8,28.96 17.27,28.96 24,22.22 24,19.94 24.38,19.56 33.53,19.56 v1(35.81,21.84)
POWER: length 23.3
  Top Layer w1.524: 7.41,34.09 5.27,34.09 4.19,35.17 4.19,47.24 7.11,50.17 CN1.1
POWER_ADC: length 34.8
  Top Layer w0.254: 36.99,20.39 36.89,20.3 R41.2 36.32,18.19 v1(36.32,18.8)
  Bottom Layer w0.254: v1(36.32,18.8) 37.08,18.8 38.74,20.45 38.74,22.61 44.07,27.94 44.43,27.94 44.47,27.98 45.45,27.98 45.48,27.94 53.72,27.94 57.66,31.88 60.2,31.88
PWM1: length 41.2
  Top Layer w0.254: U3.10 82.28,40.64 v1(71.5,40.64)
  Bottom Layer w0.254: 44.96,42.04 50.14,42.04 51.54,40.64 59.67,40.64 59.71,40.68 60.69,40.68 60.72,40.64 v1(71.5,40.64)
PWM2: length 27.2
  Bottom Layer w0.254: U3.16 67.93,39.75 63.5,39.75 62.1,38.35 60.72,38.35 60.69,38.32 59.71,38.32 59.67,38.35 59.31,38.35 55.37,34.42 44.96,34.42
SCK: length 61.7
  Top Layer w0.254: U6.5 90.3,48.64 72.01,48.64 67.56,44.2 67.56,36.32 v1(66.42,35.18)
  Bottom Layer w0.254: v1(66.42,35.18) 61.94,30.7 58.76,30.7 54.86,26.8 44.96,26.8
SCL: length 110.1
  Top Layer w0.254: U5.3 79.18,59.31 64.01,59.31 61.21,56.52 42.04,56.52 v1(41.66,56.13) ; 44.96,14.1 38.74,20.32 v1(38.74,25.02)
  Bottom Layer w0.254: v1(38.74,25.02) 34.42,29.34 26.8,29.34 OLED1.3 27.43,34.04 36.45,34.04 40.13,37.72 40.13,54.48 41.66,56.01 v1(41.66,56.13)
SDA: length 105.9
  Top Layer w0.254: U5.4 77.41,58.55 68.2,58.55 65.53,55.88 v1(44.45,55.88) ; 44.96,11.56 38.1,18.42 v1(38.1,23.62)
  Bottom Layer w0.254: v1(38.1,23.62) 38.91,24.44 38.98,24.44 39.32,24.78 39.32,25.58 35.2,29.69 28.98,29.69 OLED1.4 27.81,31.88 27.81,33.15 27.99,33.33 37.26,33.33 41.78,37.85 41.78,53.21 v1(44.45,55.88)
TRIG: length 24.8
  Top Layer w0.254: v1(53.85,52.07) 53.85,42.16 59.06,36.96 60.2,36.96
  Bottom Layer w0.254: U21.2 53.85,58.29 v1(53.85,52.07)
USART1_RX: length 58.9
  Top Layer w0.254: CN2.3 8.74,14.53 6.4,14.53 6.22,14.35 6.22,11.3 6.67,10.86 10.73,10.86 11.68,11.81 14.35,11.81 17.02,14.48 20.45,14.48 23.75,17.78 23.75,20.7 27.31,24.26 34.54,24.26 40,29.72 40,32.26 44.7,36.96 44.96,36.96
USART1_TX: length 51.5
  Top Layer w0.254: CN2.4 13.78,12.25 16.62,15.1 20.05,15.1 22.48,17.53 U26.7 22.48,21.34 26.16,25.02 33.91,25.02 39.24,30.35 39.24,33.4 44.96,39.12 44.96,39.5
W_RX: length 38.4
  Bottom Layer w0.254: U7.4 93.09,24.26 90.3,24.26 89.28,25.27 68.2,25.27 62.1,19.18 60.2,19.18
W_TX: length 37.1
  Bottom Layer w0.254: 60.2,21.72 62.48,21.72 67.18,26.42 80.01,26.42 87.25,33.66 U7.5
X1: length 48.1
  Top Layer w0.254: U27.2 29.17,45.25 33.15,41.28 39.88,41.28 40.39,40.77 48.77,40.77 52.58,36.96 52.58,31.88 60.2,24.26
X2: length 50.5
  Top Layer w0.254: U27.3 26.67,52.7 27.18,53.21 35.94,53.21 39.37,49.78 39.37,47.5 43.65,43.22 45.45,43.22 45.99,42.67 48.51,42.67 53.85,37.34 53.85,33.15 60.2,26.8
X3: length 50.3
  Top Layer w0.254: U27.4 24.51,51 24.51,52.96 25.12,53.57 36.09,53.57 43.81,45.85 46.86,45.85 54.61,38.1 54.61,34.92 60.2,29.34
$1N2843: length 3.6
  Top Layer w0.254: U26.8 21.21,18.03 20.83,17.65 19.24,17.65 C49.1
$1N2852: length 3.2
  Top Layer w0.254: USB4.4 14.12,10.51 R10.2
$1N2853: length 3.9
  Top Layer w0.254: R11.2 18.42,10.16 17.19,8.93 17.19,7.78 USB4.10
$1N4790: length 4.5
  Top Layer w0.254: U7.7 91.84,29.06 R42.2
$1N4794: length 4.5
  Top Layer w0.254: U7.6 91.82,30.61 R43.2

## Copper pours and planes (outline as drawn; the poured copper is in the pictures)
GND on Top Layer: 0,60.07 103.12,60.07 103.12,0 0,0
GND on Bottom Layer: 0,60.07 99.95,60.07 99.95,-2.03 0,-2.03

Small or netless copper shapes (teardrops, artwork), in the pictures only: 130 on Top Layer, 88 on Bottom Layer

## Text on the board
Top Silkscreen Layer: TX | RX | G | V | SWD
